# EAGLE board EEZ DIB MIO168 r1B1 (EAGLE 7.2.0), part 1 of 2
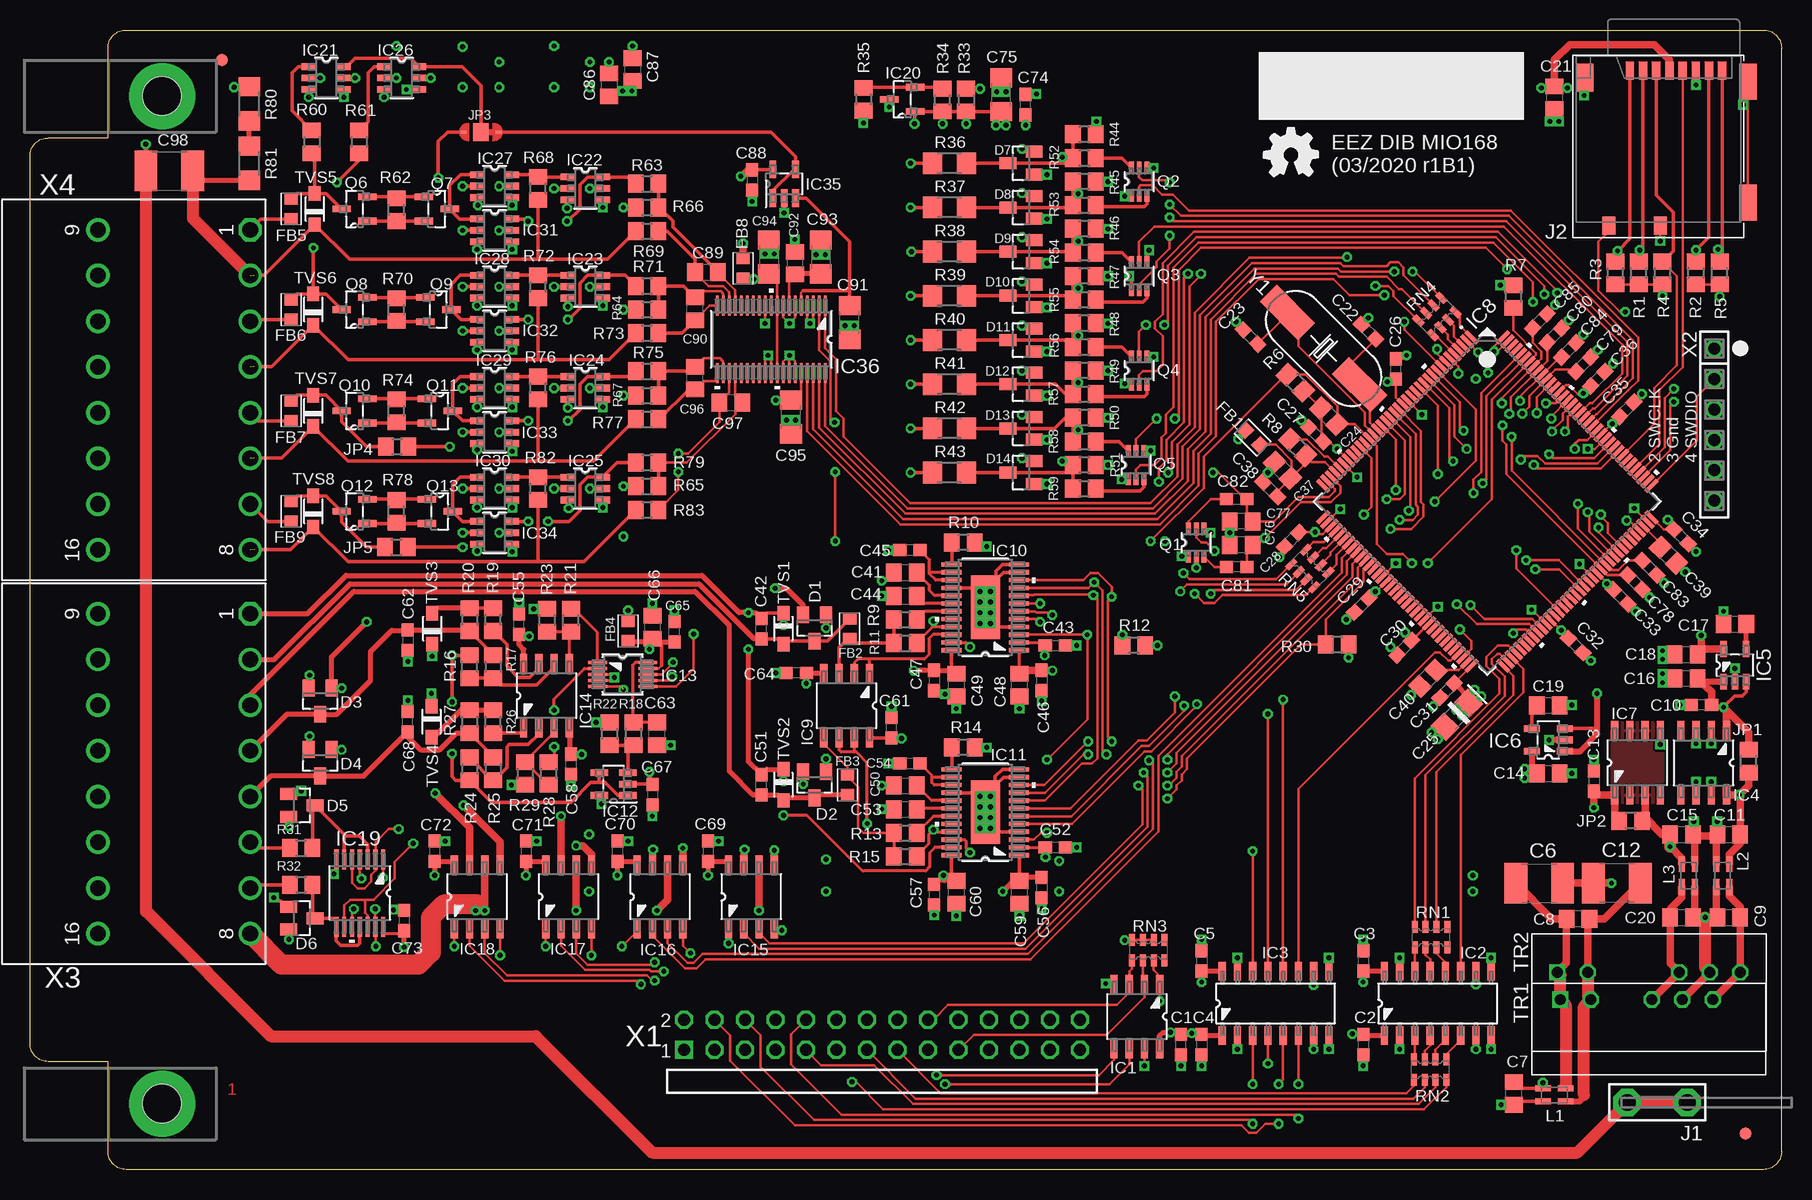
[diagram p6: board, top side]
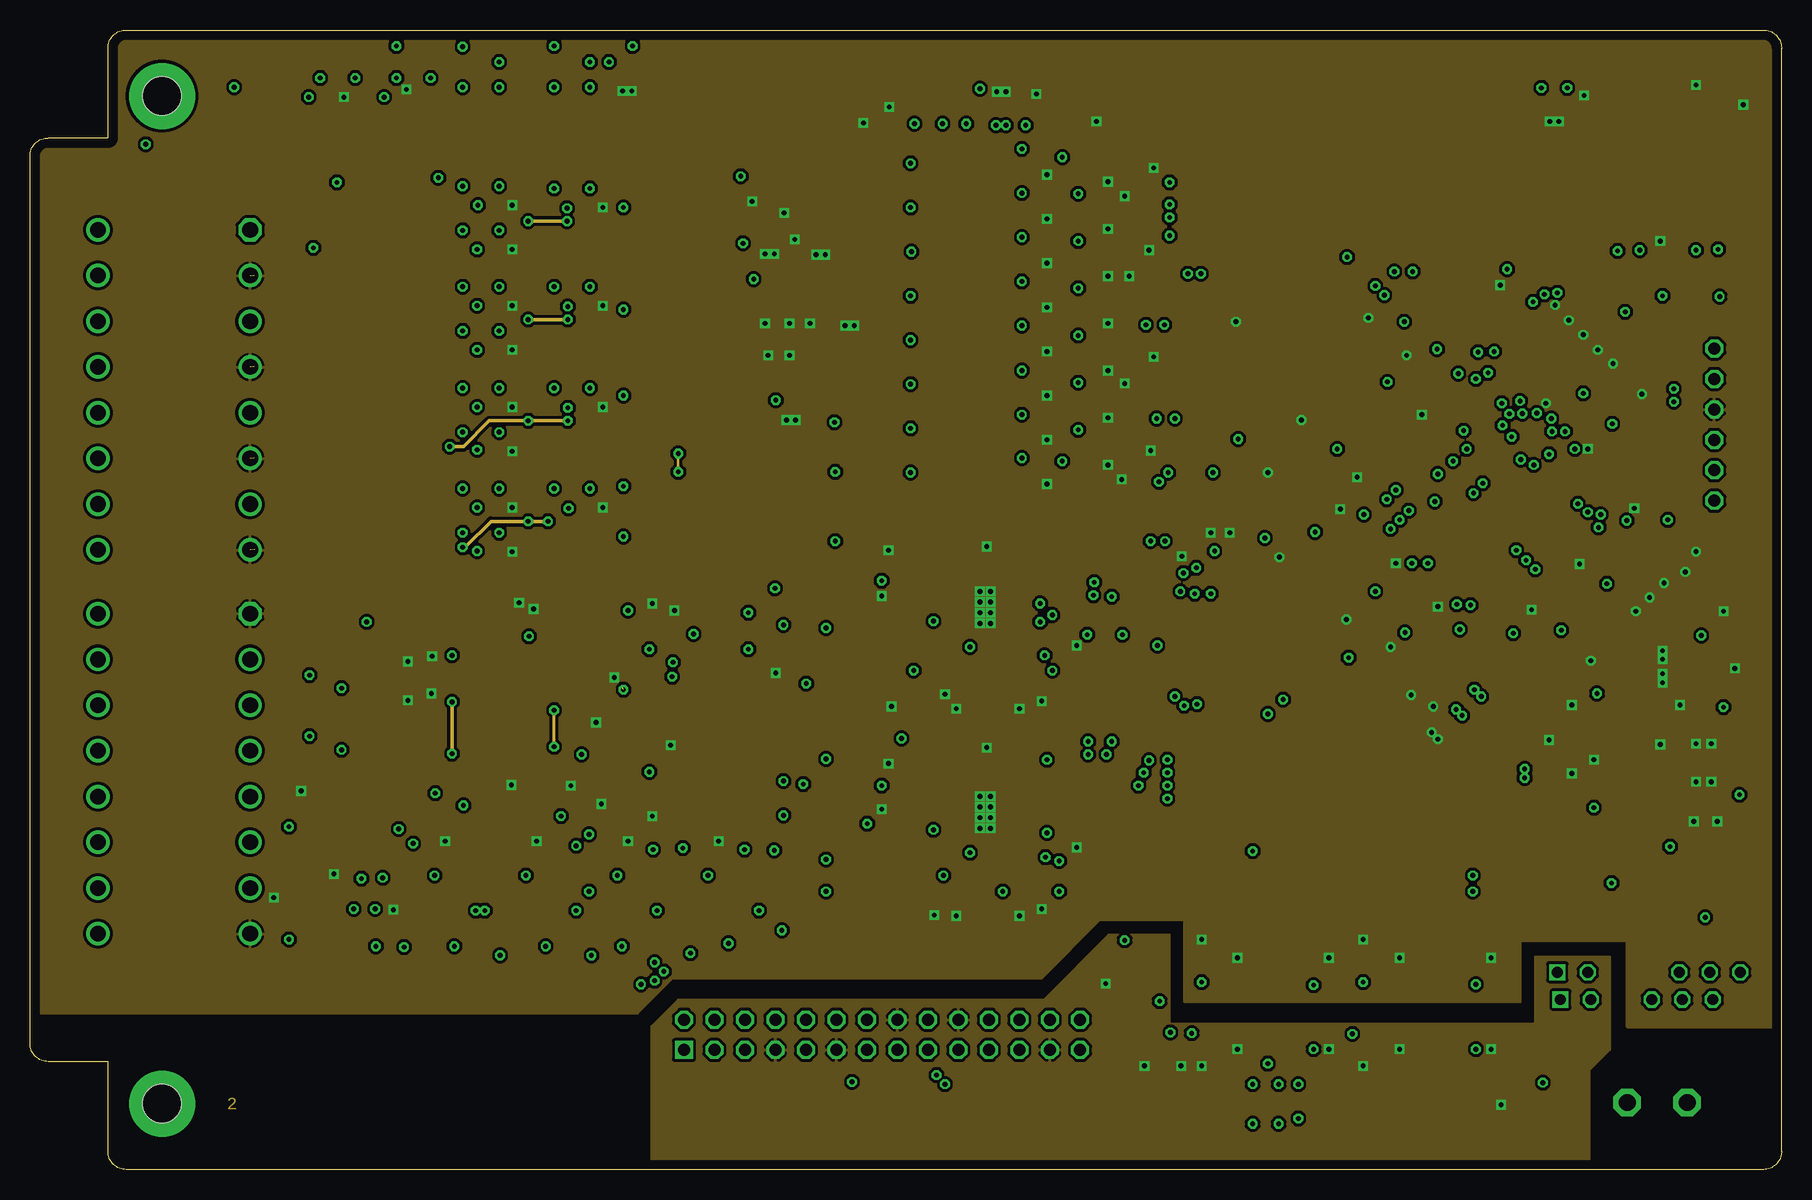
[diagram p7: board, inner layer L2]
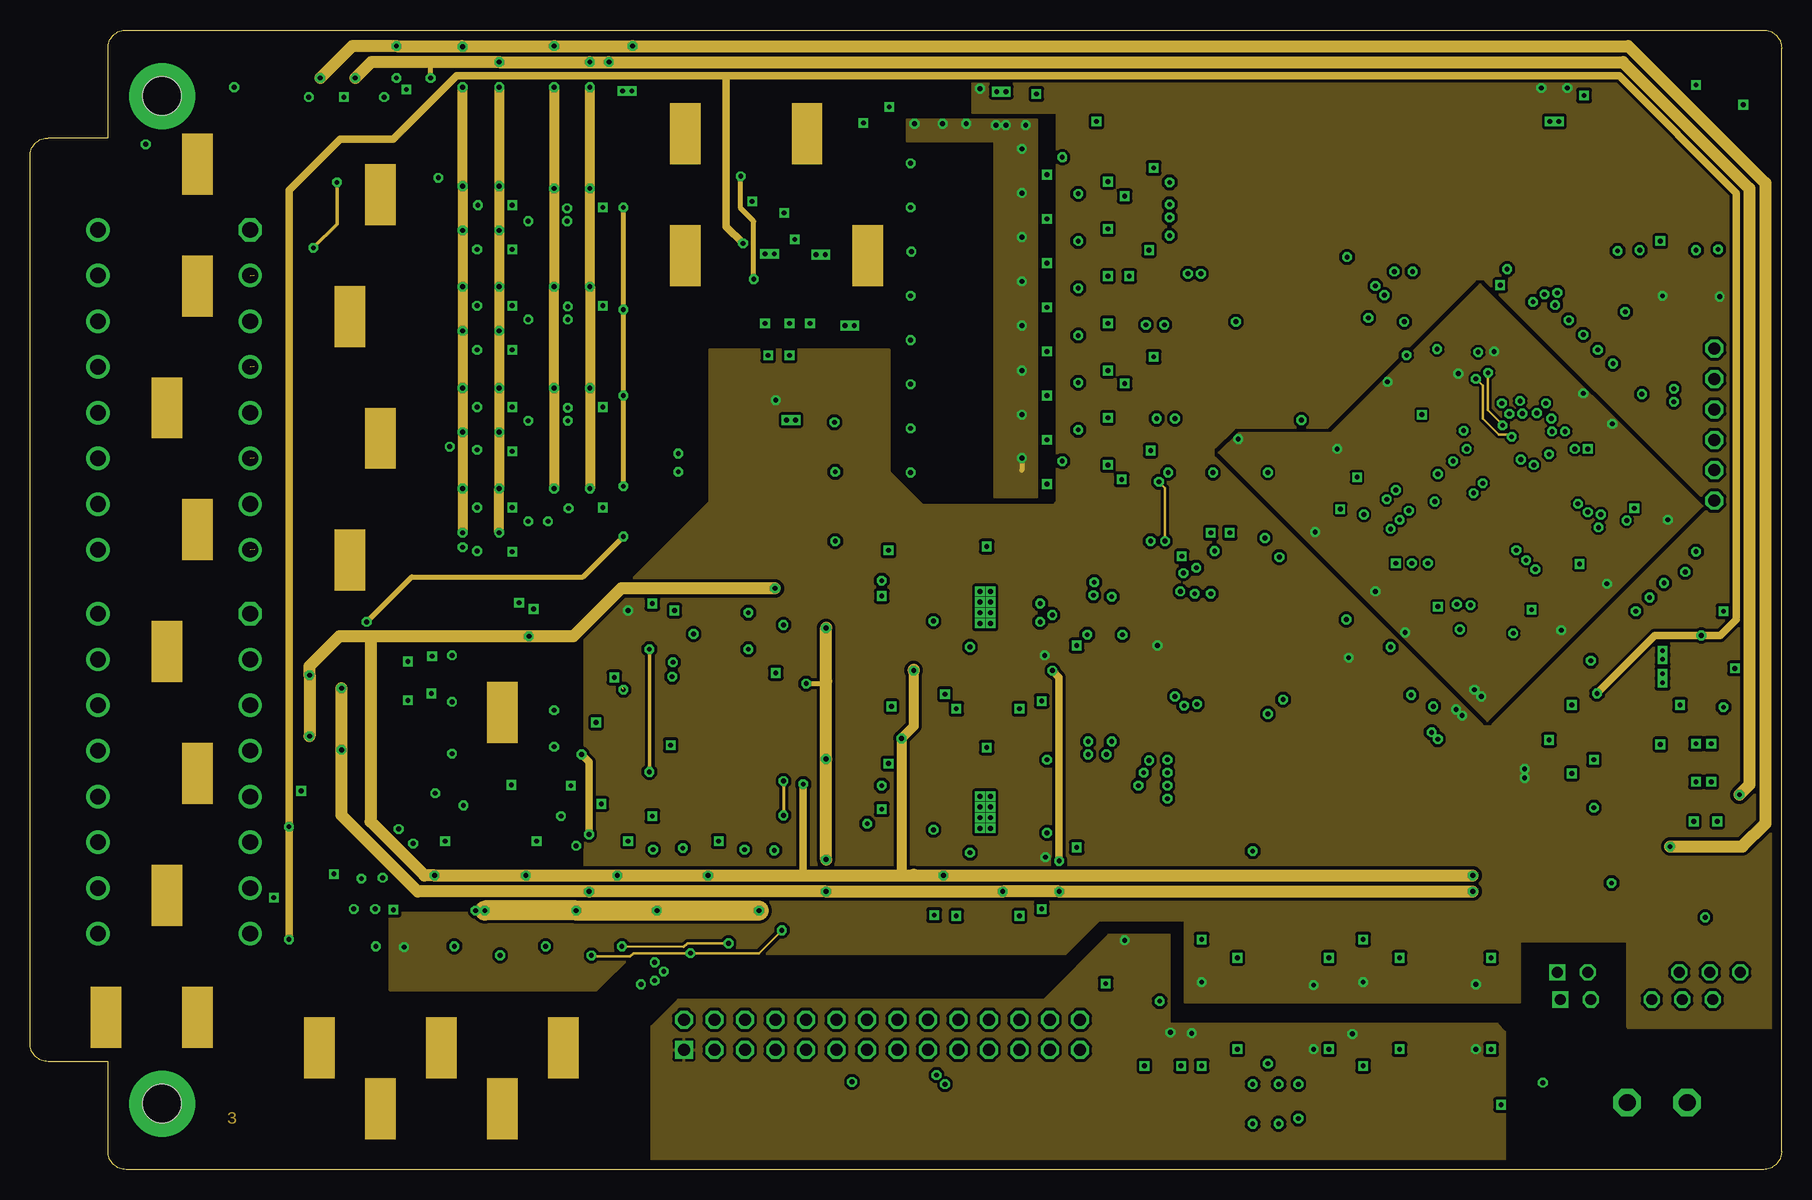
[diagram p8: board, inner layer L3]
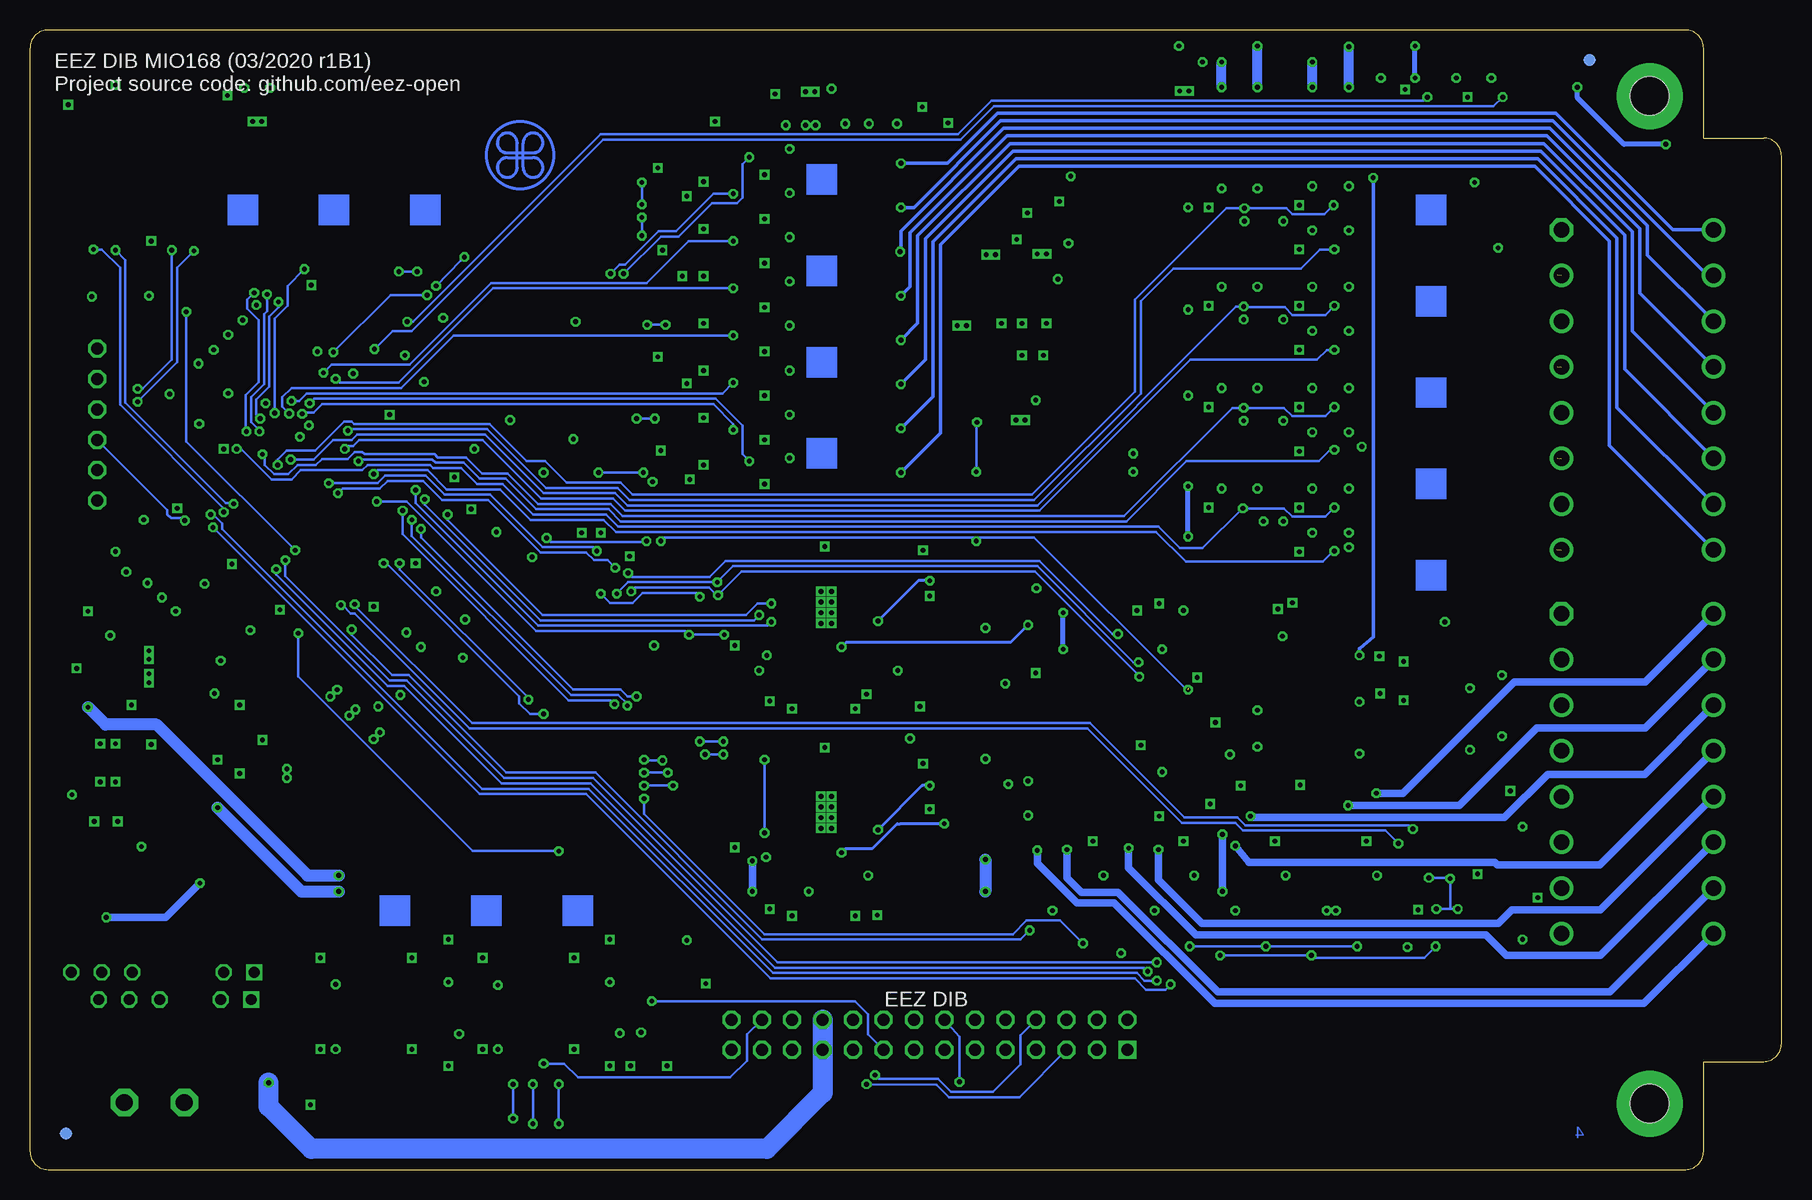
[diagram p9: board, bottom side, seen from below]

Size 146 x 95 mm. Coordinates in mm from the lower left corner, seen from the top.
Outline: 8,95 144.5,95 arc-90 146,93.5 146,1.5 arc-90 144.5,0 8,0 arc-90 6.5,1.5 6.5,9 1.5,9 arc-90 0,10.5 0,84.5 arc-90 1.5,86 6.5,86 6.5,93.5 arc-90 8,95
Copper layers (1+2+15+16): Top 0.035559375mm / dielectric 7mil / L2 0.03048125mm / dielectric 44mil / L3 0.03048125mm / dielectric 7mil / Bottom 0.035559375mm
Design rules "DIB 4-layer": minimum track width 6mil, minimum drill 0.3mm, track to track 4mil, track to pad 4mil, pad to pad 4mil, via to via 4mil, smd to smd 4mil, copper to edge 30mil, drill to drill 8mil, minimum pad ring 4mil, minimum via ring 8mil, stop-mask expansion 2.5mil, vias tented up to drill 0.6mm, thermal gap 8mil
Net classes: 0 default: width 0.203 mm, drill 0.3 mm, clearance 0.203 mm; 1 lvds: width 0.152 mm, drill 0.3 mm, clearance 0.152 mm to class 0, clearance 0.152 mm; 2 gnd: width 0.254 mm, drill 0.584 mm, clearance 0.254 mm; 3 diff_in: width 0.254 mm, drill 0.584 mm, clearance 0.203 mm to class 0, clearance 0.203 mm to class 1, clearance 0.203 mm to class 2, clearance 0.203 mm
vRestrict: area 0,0 to 42,14; area 53,0 to 128,8.5

## Footprints (pad centres in the part's own frame; a part is rotated, then mirrored left to right if it is on the bottom)
C0603 = smd 1.1 x 1: 1 -0.85,0; 2 0.85,0
C1812 = smd 1.9 x 3.4: 1 -1.95,0; 2 1.95,0
C0805 = smd 1.3 x 1.5: 1 -0.95,0; 2 0.95,0
EC1206 = smd 1.6 x 1.8: + -1.4,0; - 1.4,0
C1206 = smd 1.6 x 1.8: 1 -1.4,0; 2 1.4,0
SOT23 = smd 1 x 1.4: 1 -0.95,-1.1; 2 0.95,-1.1; 3 0,1.1
BEAD0603 = smd 1 x 1.1: P$1 -0.85,0; P$2 0.85,0
FIDUCIAL_DUAL = smd 1.016 x 1.016 bottom: B 0,0 | smd 1.016 x 1.016: T 0,0
SOIC127P600X173-8N = smd 1.55 x 0.6: 1 -2.7,1.9; 2 -2.7,0.63; 3 -2.7,-0.64; 4 -2.7,-1.91; 5 2.7,-1.91; 6 2.7,-0.64; 7 2.7,0.63; 8 2.7,1.9
SOIC-16 = smd 1.549 x 0.61: 1 -2.692,4.445; 2 -2.692,3.175; 3 -2.692,1.905; 4 -2.692,0.635; 5 -2.692,-0.635; 6 -2.692,-1.905; 7 -2.692,-3.175; 8 -2.692,-4.445; 9 2.692,-4.445; 10 2.692,-3.175; 11 2.692,-1.905; 12 2.692,-0.635; 13 2.692,0.635; 14 2.692,1.905; 15 2.692,3.175; 16 2.692,4.445
SOT95P270X145-5N = smd 1.321 x 0.559: 1 -1.372,0.94; 2 -1.372,0; 3 -1.372,-0.94; 4 1.372,-0.94; 5 1.372,0.94
LQFP-144 = smd 1.35 x 0.35: 1 -10.625,8.75; 2 -10.625,8.25; 3 -10.625,7.75; 4 -10.625,7.25; 5 -10.625,6.75; 6 -10.625,6.25; 7 -10.625,5.75; 8 -10.625,5.25; 9 -10.625,4.75; 10 -10.625,4.25; 11 -10.625,3.75; 12 -10.625,3.25; 13 -10.625,2.75; 14 -10.625,2.25; 15 -10.625,1.75; 16 -10.625,1.25; 17 -10.625,0.75; 18 -10.625,0.25; 19 -10.625,-0.25; 20 -10.625,-0.75; 21 -10.625,-1.25; 22 -10.625,-1.75; 23 -10.625,-2.25; 24 -10.625,-2.75; 25 -10.625,-3.25; 26 -10.625,-3.75; 27 -10.625,-4.25; 28 -10.625,-4.75; 29 -10.625,-5.25; 30 -10.625,-5.75; 31 -10.625,-6.25; 32 -10.625,-6.75; 33 -10.625,-7.25; 34 -10.625,-7.75; 35 -10.625,-8.25; 36 -10.625,-8.75; 73 10.625,-8.75; 74 10.625,-8.25; 75 10.625,-7.75; 76 10.625,-7.25; 77 10.625,-6.75; 78 10.625,-6.25; 79 10.625,-5.75; 80 10.625,-5.25; 81 10.625,-4.75; 82 10.625,-4.25; 83 10.625,-3.75; 84 10.625,-3.25; 85 10.625,-2.75; 86 10.625,-2.25; 87 10.625,-1.75; 88 10.625,-1.25; 89 10.625,-0.75; 90 10.625,-0.25; 91 10.625,0.25; 92 10.625,0.75; 93 10.625,1.25; 94 10.625,1.75; 95 10.625,2.25; 96 10.625,2.75; 97 10.625,3.25; 98 10.625,3.75; 99 10.625,4.25; 100 10.625,4.75; 101 10.625,5.25; 102 10.625,5.75; 103 10.625,6.25; 104 10.625,6.75; 105 10.625,7.25; 106 10.625,7.75; 107 10.625,8.25; 108 10.625,8.75 | smd 0.35 x 1.35: 37 -8.75,-10.625; 38 -8.25,-10.625; 39 -7.75,-10.625; 40 -7.25,-10.625; 41 -6.75,-10.625; 42 -6.25,-10.625; 43 -5.75,-10.625; 44 -5.25,-10.625; 45 -4.75,-10.625; 46 -4.25,-10.625; 47 -3.75,-10.625; 48 -3.25,-10.625; 49 -2.75,-10.625; 50 -2.25,-10.625; 51 -1.75,-10.625; 52 -1.25,-10.625; 53 -0.75,-10.625; 54 -0.25,-10.625; 55 0.25,-10.625; 56 0.75,-10.625; 57 1.25,-10.625; 58 1.75,-10.625; 59 2.25,-10.625; 60 2.75,-10.625; 61 3.25,-10.625; 62 3.75,-10.625; 63 4.25,-10.625; 64 4.75,-10.625; 65 5.25,-10.625; 66 5.75,-10.625; 67 6.25,-10.625; 68 6.75,-10.625; 69 7.25,-10.625; 70 7.75,-10.625; 71 8.25,-10.625; 72 8.75,-10.625; 109 8.75,10.625; 110 8.25,10.625; 111 7.75,10.625; 112 7.25,10.625; 113 6.75,10.625; 114 6.25,10.625; 115 5.75,10.625; 116 5.25,10.625; 117 4.75,10.625; 118 4.25,10.625; 119 3.75,10.625; 120 3.25,10.625; 121 2.75,10.625; 122 2.25,10.625; 123 1.75,10.625; 124 1.25,10.625; 125 0.75,10.625; 126 0.25,10.625; 127 -0.25,10.625; 128 -0.75,10.625; 129 -1.25,10.625; 130 -1.75,10.625; 131 -2.25,10.625; 132 -2.75,10.625; 133 -3.25,10.625; 134 -3.75,10.625; 135 -4.25,10.625; 136 -4.75,10.625; 137 -5.25,10.625; 138 -5.75,10.625; 139 -6.25,10.625; 140 -6.75,10.625; 141 -7.25,10.625; 142 -7.75,10.625; 143 -8.25,10.625; 144 -8.75,10.625
PWP24 = smd 1.676 x 0.356: 1 -2.819,3.575; 2 -2.819,2.925; 3 -2.819,2.275; 4 -2.819,1.625; 5 -2.819,0.975; 6 -2.819,0.325; 7 -2.819,-0.325; 8 -2.819,-0.975; 9 -2.819,-1.625; 10 -2.819,-2.275; 11 -2.819,-2.925; 12 -2.819,-3.575; 13 2.819,-3.575; 14 2.819,-2.925; 15 2.819,-2.275; 16 2.819,-1.625; 17 2.819,-0.975; 18 2.819,-0.325; 19 2.819,0.325; 20 2.819,0.975; 21 2.819,1.625; 22 2.819,2.275; 23 2.819,2.925; 24 2.819,3.575 | smd 2.413 x 5.283: 25 0,0
DBV5 = smd 1.473 x 0.559: 1 -1.194,0.95; 2 -1.194,0; 3 -1.194,-0.95; 4 1.194,-0.95; 5 1.194,0.95
DGS10 = smd 1.575 x 0.254: 1 -2.095,1; 2 -2.095,0.5; 3 -2.095,0; 4 -2.095,-0.5; 5 -2.095,-1; 6 2.095,-1; 7 2.095,-0.5; 8 2.095,0; 9 2.095,0.5; 10 2.095,1
PW14 = smd 1.676 x 0.356: 1 -2.819,1.95; 2 -2.819,1.3; 3 -2.819,0.65; 4 -2.819,0; 5 -2.819,-0.65; 6 -2.819,-1.3; 7 -2.819,-1.95; 8 2.819,-1.95; 9 2.819,-1.3; 10 2.819,-0.65; 11 2.819,0; 12 2.819,0.65; 13 2.819,1.3; 14 2.819,1.95
SOT103P240X110-3N = smd 1.524 x 0.559: 1 -1.079,1.016; 2 -1.079,-1.016; 3 1.079,0
DG6_TSOP6 = smd 1.194 x 0.559: 1 -1.448,0.95; 2 -1.448,0; 3 -1.448,-0.95; 4 1.448,-0.95; 5 1.448,0; 6 1.448,0.95
DBT38 = smd 1.676 x 0.229: 1 -2.819,4.5; 2 -2.819,4; 3 -2.819,3.5; 4 -2.819,3; 5 -2.819,2.5; 6 -2.819,2; 7 -2.819,1.5; 8 -2.819,1; 9 -2.819,0.5; 10 -2.819,0; 11 -2.819,-0.5; 12 -2.819,-1; 13 -2.819,-1.5; 14 -2.819,-2; 15 -2.819,-2.5; 16 -2.819,-3; 17 -2.819,-3.5; 18 -2.819,-4; 19 -2.819,-4.5; 20 2.819,-4.5; 21 2.819,-4; 22 2.819,-3.5; 23 2.819,-3; 24 2.819,-2.5; 25 2.819,-2; 26 2.819,-1.5; 27 2.819,-1; 28 2.819,-0.5; 29 2.819,0; 30 2.819,0.5; 31 2.819,1; 32 2.819,1.5; 33 2.819,2; 34 2.819,2.5; 35 2.819,3; 36 2.819,3.5; 37 2.819,4; 38 2.819,4.5
PCB_TAB-4907 = drill 1.4 pad 2.3 octagon: 1 -2.5,0; 2 2.5,0
5033981892 = smd 0.7 x 1.5: 1 4.45,12.6; 2 5.55,12.6; 3 6.65,12.6; 4 7.75,12.6; 5 8.85,12.6; 6 9.95,12.6; 7 11.05,12.6; 8 12.15,12.6 | smd 1.45 x 2.33: S 0.7,12.04 | smd 1.45 x 3: S1 14.3,11.7; S2 14.3,1.6 | smd 1.1 x 1.5: SW1 2.7,-0.3; SW2 7,-0.3
R_0805 = smd 1.3 x 1.5: 1 -0.95,0; 2 0.95,0
JP3-CUT = smd 1.27 x 1.524: COM 0,0 | smd 0.508 x 0.254: NC -1.46,0; NO 1.46,0
PCB-MB = hole 3.2: 0,0
MURATA_DLW21S = smd 1.3 x 0.5: 1 -0.95,-0.55; 2 0.95,-0.55; 3 0.95,0.55; 4 -0.95,0.55
SC88 = smd 0.991 x 0.406: 1 -1.168,0.65; 2 -1.168,0; 3 -1.168,-0.65; 4 1.168,-0.65; 5 1.168,0; 6 1.168,0.65
R0805 = smd 1.3 x 1.5: 1 -0.95,0; 2 0.95,0
R1206 = smd 1.6 x 1.803: 1 -1.422,0; 2 1.422,0
CAY16 = smd 0.5 x 1: 1 -1.35,-0.85; 2 -0.45,-0.85; 3 0.45,-0.85; 4 1.35,-0.85; 5 1.35,0.85; 6 0.45,0.85; 7 -0.45,0.85; 8 -1.35,0.85
SHORT_NOHOLE = smd 0.5 x 0.25 bottom: 1 0,0.117; 2 0,-0.117
TBA2 = drill 0.9 square: 1 0,0 | drill 0.9 octagon: 2 2.54,0; 4 7.62,0; 5 10.16,0; 6 12.7,0
MDD02 = drill 0.9 square: 1 0,0 | drill 0.9 octagon: 2 2.54,0; 5 10.16,0; 6 12.7,0; 7 15.24,0
SOD323-BIDIR = smd 1.2 x 1: C1 -1.3,0; C2 1.3,0
77317-104-28LF = drill 1 pad 1.5 square: 1 -33.02,-2.54 | drill 1 pad 1.5 octagon: 2 -33.02,0; 3 -30.48,-2.54; 4 -30.48,0; 5 -27.94,-2.54; 6 -27.94,0; 7 -25.4,-2.54; 8 -25.4,0; 9 -22.86,-2.54; 10 -22.86,0; 11 -20.32,-2.54; 12 -20.32,0; 13 -17.78,-2.54; 14 -17.78,0; 15 -15.24,-2.54; 16 -15.24,0; 17 -12.7,-2.54; 18 -12.7,0; 19 -10.16,-2.54; 20 -10.16,0; 21 -7.62,-2.54; 22 -7.62,0; 23 -5.08,-2.54; 24 -5.08,0; 25 -2.54,-2.54; 26 -2.54,0; 27 0,-2.54; 28 0,0
SSW-106-02-S-S = drill 1 pad 1.5 octagon: 1 -6.35,0; 2 -3.81,0; 3 -1.27,0; 4 1.27,0; 5 3.81,0; 6 6.35,0
691327310016 = drill 1.3 octagon: 1 -13.335,6.35 | drill 1.3: 2 -9.525,6.35; 3 -5.715,6.35; 4 -1.905,6.35; 5 1.905,6.35; 6 5.715,6.35; 7 9.525,6.35; 8 13.335,6.35; 9 -13.335,-6.35; 10 -9.525,-6.35; 11 -5.715,-6.35; 12 -1.905,-6.35; 13 1.905,-6.35; 14 5.715,-6.35; 15 9.525,-6.35; 16 13.335,-6.35
HC-49/4H = smd 4.5 x 2: 1 -4.25,0; 2 4.25,0

## Placement (x,y rotation side)
C1  100n  [C0603]  95.95,10.41 90 top
C2  100n  [C0603]  111.12,10.41 270 top
C3  100n  [C0603]  111.12,17.4 270 top
C4  100n  [C0603]  97.66,10.41 270 top
C5  100n  [C0603]  97.66,17.4 270 top
C6  4n7/1kV  [C1812]  125.79,23.88 0 top
C7  1u  [C0805]  123.7,6.35 90 top
C8  1u  [C0805]  129.03,20.89 180 top
C9  1u  [C0805]  141.6,21.02 0 top
C10  100n  [C0603]  139.32,38.73 180 top
C11  1u  [C0805]  141.6,27.94 0 top
C12  4n7/1kV  [C1812]  132.27,23.88 180 top
C13  100n  [C0603]  130.37,32.38 270 top
C14  2u2  [C0805]  126.56,33.02 0 top
C15  1u  [C0805]  137.67,27.94 0 top
C16  4u7  [C0805]  138.05,40.96 0 top
C17  10n  [C0805]  142.11,45.47 0 top
C18  4u7  [C0805]  138.05,42.93 0 top
C19  10n  [C0805]  126.56,38.67 180 top
C20  1u  [C0805]  137.67,21.02 0 top
C21  4u7  [C0805]  127.06,89.34 270 top
C22  18p  [C0603]  111.57,69.85 315 top
C23  18p  [C0603]  101.73,69.41 315 top
C24  1n  [C0805]  108.27,62.8 135 top
C25  4u7  [EC1206]  118.94,37.91 225 top
C26  100n  [C0603]  113.86,66.74 90 top
C27  100n  [C0603]  107.19,61.28 135 top
C28  100n  [C0603]  105.16,52.51 225 top
C29  100n  [C0603]  111,47.05 225 top
C30  100n  [C0603]  114.55,43.5 225 top
C31  100n  [C0603]  118.11,39.94 225 top
C32  100n  [C0603]  128.84,43.69 315 top
C33  100n  [C0603]  132.59,47.75 315 top
C34  100n  [C0603]  137.63,52.77 315 top
C35  100n  [C0603]  133.1,63.37 45 top
C36  100n  [C0603]  130.68,65.91 45 top
C37  1u  [C0805]  104.39,58.29 135 top
C38  100n  [C0603]  103.38,56.71 135 top
C39  2u2  [C0805]  136.58,51.21 135 top
C40  2u2  [C0805]  116.52,40.96 45 top
C41  2n2  [C0805]  72.96,49.78 0 top
C42  100n  [C0603]  60.96,45.09 90 top
C43  100n  [C0603]  85.47,43.69 0 top
C44  22n  [C0805]  72.96,47.82 0 top
C45  100n  [C0603]  73.34,51.63 180 top
C46  100n  [C0603]  84.33,40.77 270 top
C47  100n  [C0603]  75.37,40.77 270 top
C48  4u7  [C0805]  82.49,40.39 90 top
C49  4u7  [C0805]  77.22,40.39 90 top
C50  2n2  [C0805]  72.96,32 0 top
C51  100n  [C0603]  60.96,32.07 90 top
C52  100n  [C0603]  85.47,26.86 0 top
C53  22n  [C0805]  72.96,30.04 0 top
C54  100n  [C0603]  73.34,33.85 180 top
C55  100n  [C0603]  40.77,45.47 90 top
C56  100n  [C0603]  84.33,23.5 270 top
C57  100n  [C0603]  75.37,22.92 270 top
C58  100n  [C0603]  45.09,33.78 270 top
C59  4u7  [C0805]  82.49,23.11 90 top
C60  4u7  [C0805]  77.22,23.11 90 top
C61  100n  [C0603]  71.82,36.83 90 top
C62  100n  [C0603]  31.5,44.13 270 top
C63  150n  [C0805]  52.26,36.32 90 top
C64  100n  [C0603]  63.88,41.4 180 top
C65  100n  [C0603]  53.72,44.83 90 top
C66  4u7  [C0805]  51.88,45.21 270 top
C67  100n  [C0603]  51.88,31.24 270 top
C68  100n  [C0603]  31.5,37.34 90 top
C69  100n  [C0603]  56.52,26.54 270 top
C70  100n  [C0603]  48.96,26.54 270 top
C71  100n  [C0603]  41.34,26.54 270 top
C72  100n  [C0603]  33.72,26.54 270 top
C73  100n  [C0603]  31.18,20.76 270 top
C74  100n  [C0603]  82.99,88.77 90 top
C75  10u  [C1206]  80.96,89.6 90 top
C76  330p  [C0805]  100.97,52.07 180 top
C77  330p  [C0805]  100.97,54.04 180 top
C78  100n  [C0603]  133.79,48.96 315 top
C79  100n  [C0603]  129.48,67.12 45 top
C80  100n  [C0603]  127.06,69.53 45 top
C81  100n  [C0603]  100.58,50.23 180 top
C82  100n  [C0603]  100.58,55.88 180 top
C83  100n  [C0603]  135,50.16 315 top
C84  100n  [C0603]  128.27,68.33 45 top
C85  100n  [C0603]  125.86,70.74 45 top
C86  1u  [C0805]  48.26,90.42 270 top
C87  1u  [C0805]  50.23,91.69 270 top
C88  100n  [C0603]  60.2,82.49 270 top
C89  2n2  [C0805]  56.39,74.8 0 top
C90  2n2  [C0805]  55.44,71.75 90 top
C91  10u  [C1206]  68.33,70.61 90 top
C92  1u  [C0805]  63.75,75.56 270 top
C93  22u  [C1206]  65.91,76.07 270 top
C94  10u  [C1206]  61.59,76.07 270 top
C95  10u  [C1206]  63.44,62.74 90 top
C96  2n2  [C0805]  55.44,65.98 90 top
C97  2n2  [C0805]  58.42,63.94 0 top
C98  4n7/1kV  [C1812]  11.62,83.25 0 top
D1  BAT54SFILM  [SOT23]  65.41,45.15 180 top
D2  BAT54SFILM  [SOT23]  65.41,32.07 180 top
D3  BAT54SFILM  [SOT23]  24.19,39.05 180 top
D4  BAT54SFILM  [SOT23]  24.19,33.91 180 top
D5  BAT54SFILM  [SOT23]  22.67,30.35 270 top
D6  BAT54SFILM  [SOT23]  22.67,20.95 270 top
D7  BAT54SFILM  [SOT23]  82.61,83.88 90 top
D8  BAT54SFILM  [SOT23]  82.61,80.2 90 top
D9  BAT54SFILM  [SOT23]  82.61,76.52 90 top
D10  BAT54SFILM  [SOT23]  82.61,72.83 90 top
D11  BAT54SFILM  [SOT23]  82.61,69.15 90 top
D12  BAT54SFILM  [SOT23]  82.61,65.47 90 top
D13  BAT54SFILM  [SOT23]  82.61,61.79 90 top
D14  BAT54SFILM  [SOT23]  82.61,58.1 90 top
EEZ_SIGNATURE  SIGNATURESMALL  [SIGNATURE_5MM]  105.14,84.56 180 top
FB1  BLM18AG102SH1D  [BEAD0603]  101.92,61.02 315 top
FB2  BLM18AG102SH1D  [BEAD0603]  68.33,45.09 90 top
FB3  BLM18AG102SH1D  [BEAD0603]  68.14,32.07 270 top
FB4  BLM18AG102SH1D  [BEAD0603]  49.85,44.89 90 top
FB5  BLM18AG102SH1D  [BEAD0603]  21.78,80.07 90 top
FB6  BLM18AG102SH1D  [BEAD0603]  21.78,71.69 90 top
FB7  BLM18AG102SH1D  [BEAD0603]  21.78,63.25 90 top
FB8  BLM18AG102SH1D  [BEAD0603]  59.44,75.12 270 top
FB9  BLM18AG102SH1D  [BEAD0603]  21.78,54.86 90 top
FM1  FIDUCIAL_2  [FIDUCIAL_DUAL]  16,92.5 0 top
FM2  FIDUCIAL_2  [FIDUCIAL_DUAL]  143,3 0 top
IC1  M24C32-WMN6P  [SOIC127P600X173-8N]  92.27,12.76 270 top
IC2  Si8641BB-B-IS1  [SOIC-16]  117.35,13.84 90 top
IC3  Si8641BB-B-IS1  [SOIC-16]  103.82,13.84 90 top
IC4  L78L12  [SOIC127P600X173-8N]  139.51,33.91 270 top
IC5  LP2985-50DBVR  [SOT95P270X145-5N]  142.11,42.04 90 top
IC6  LP2985-33DBVR  [SOT95P270X145-5N]  126.56,35.81 180 top
IC7  L79L12  [SOIC127P600X173-8N]  133.99,33.91 90 top
IC8  STM32F446ZCT6  [LQFP-144]  121.48,55.69 315 top
IC9  OPA2196IDR  [SOIC127P600X173-8N]  68.07,38.67 270 top
IC10  DAC7760IPWPR  [PWP24]  79.63,46.86 180 top
IC11  DAC7760IPWPR  [PWP24]  79.63,29.78 180 top
IC12  OPA376AIDBVR  [DBV5]  48.64,32.13 180 top
IC13  DAC7563TDGSR  [DGS10]  49.4,41.27 0 top
IC14  OPA2196IDR  [SOIC127P600X173-8N]  43.05,39.5 90 top
IC15  BTS3408G  [SOIC127P600X173-8N]  60.13,22.73 90 top
IC16  BTS3408G  [SOIC127P600X173-8N]  52.51,22.73 90 top
IC17  BTS3408G  [SOIC127P600X173-8N]  44.89,22.73 90 top
IC18  BTS3408G  [SOIC127P600X173-8N]  37.27,22.73 90 top
IC19  74HC126PW,118  [PW14]  27.5,23.05 270 top
IC20  TL431B  [SOT103P240X110-3N]  72.71,89.22 180 top
IC21  DG468DV-T1-E3  [DG6_TSOP6]  24.7,91 0 top
IC22  DG468DV-T1-E3  [DG6_TSOP6]  46.29,81.79 0 top
IC23  DG468DV-T1-E3  [DG6_TSOP6]  46.29,73.6 0 top
IC24  DG468DV-T1-E3  [DG6_TSOP6]  46.29,65.15 0 top
IC25  DG468DV-T1-E3  [DG6_TSOP6]  46.29,56.77 0 top
IC26  DG468DV-T1-E3  [DG6_TSOP6]  30.99,91 0 top
IC27  DG468DV-T1-E3  [DG6_TSOP6]  38.73,81.98 0 top
IC28  DG468DV-T1-E3  [DG6_TSOP6]  38.73,73.6 0 top
IC29  DG468DV-T1-E3  [DG6_TSOP6]  38.73,65.15 0 top
IC30  DG468DV-T1-E3  [DG6_TSOP6]  38.73,56.77 0 top
IC31  DG468DV-T1-E3  [DG6_TSOP6]  38.73,78.3 0 top
IC32  DG468DV-T1-E3  [DG6_TSOP6]  38.73,69.91 0 top
IC33  DG468DV-T1-E3  [DG6_TSOP6]  38.73,61.47 0 top
IC34  DG468DV-T1-E3  [DG6_TSOP6]  38.73,53.09 0 top
IC35  OPA376AIDBVR  [DBV5]  62.87,82.17 90 top
IC36  ADS8674IDBT  [DBT38]  61.79,69.22 270 top
J1  4907  [PCB_TAB-4907]  135.64,5.59 180 top
J2  503398-1892  [5033981892]  128.91,78.99 0 top
JP1  JP2-CUT-0805  [R_0805]  143.26,34.04 90 top
JP2  JP2-CUT-0805  [R_0805]  133.41,29.08 180 top
JP3  JP3-CUT  [JP3-CUT]  37.59,86.49 180 top
JP4  JP2-CUT-0805  [R_0805]  30.61,60.26 0 top
JP5  JP2-CUT-0805  [R_0805]  30.54,51.88 0 top
KK1  PCB-MB  [PCB-MB]  11,89.5 0 top
KK2  PCB-MB  [PCB-MB]  11,5.5 0 top
L1  DLW21SN371SQ2L  [MURATA_DLW21S]  127.06,6.22 0 top
L2  DLW21SN371SQ2L  [MURATA_DLW21S]  141.1,24.51 90 top
L3  DLW21SN371SQ2L  [MURATA_DLW21S]  138.24,24.51 90 top
Q1  2N7002PS,115  [SC88]  97.22,52.26 90 top
Q2  2N7002PS,115  [SC88]  92.46,82.36 90 top
Q3  2N7002PS,115  [SC88]  92.46,74.49 90 top
Q4  2N7002PS,115  [SC88]  92.46,66.61 90 top
Q5  2N7002PS,115  [SC88]  92.2,58.74 90 top
Q6  BSS169  [SOT103P240X110-3N]  27.05,80.07 180 top
Q7  BSS169  [SOT103P240X110-3N]  33.91,80.07 0 top
Q8  BSS169  [SOT103P240X110-3N]  27.05,71.69 180 top
Q9  BSS169  [SOT103P240X110-3N]  34.04,71.69 0 top
Q10  BSS169  [SOT103P240X110-3N]  27.05,63.25 180 top
Q11  BSS169  [SOT103P240X110-3N]  34.16,63.25 0 top
Q12  BSS169  [SOT103P240X110-3N]  27.05,54.86 180 top
Q13  BSS169  [SOT103P240X110-3N]  34.16,54.86 0 top
R1  47K  [R0805]  134.11,74.74 90 top
R2  47K  [R0805]  138.87,74.74 90 top
R3  47K  [R0805]  132.14,74.74 90 top
R4  47K  [R0805]  136.08,74.74 90 top
R5  47K  [R0805]  140.84,74.74 90 top
R6  4K7  [R0805]  105.47,65.6 135 top
R7  10K  [R0805]  123.63,72.77 270 top
R8  47R  [R0805]  105.66,60.2 135 top
R9  15R  [R0805]  72.96,45.85 0 top
R10  N.C.  [R0805]  77.79,52.26 180 top
R11  15R  [R0805]  72.96,43.88 0 top
R12  10K  [R0805]  92.01,43.69 180 top
R13  15R  [R0805]  72.96,28.07 0 top
R14  N.C.  [R0805]  77.79,35.18 180 top
R15  15R  [R0805]  72.96,26.1 0 top
R16  9K09 0.1%  [R0805]  36.64,41.91 90 top
R17  75K 0.1%  [R0805]  38.61,41.91 270 top
R18  9K09 0.1%  [R0805]  50.29,36.32 270 top
R19  180R  [R0805]  38.61,45.85 90 top
R20  47R  [R0805]  36.64,45.85 270 top
R21  9K09 0.1%  [R0805]  45.09,45.78 90 top
R22  9K09 0.1%  [R0805]  48.32,36.32 90 top
R23  75K 0.1%  [R0805]  43.12,45.78 90 top
R24  9K09 0.1%  [R0805]  36.64,33.4 270 top
R25  75K 0.1%  [R0805]  38.61,33.4 270 top
R26  180R  [R0805]  38.61,37.34 90 top
R27  47R  [R0805]  36.64,37.34 270 top
R28  9K09 0.1%  [R0805]  43.24,33.02 90 top
R29  75K 0.1%  [R0805]  41.27,33.02 270 top
R30  10K  [R0805]  108.97,43.75 180 top
R31  100R  [R0805]  22.61,26.8 0 top
R32  100R  [R0805]  22.61,23.75 0 top
R33  100R  [R0805]  78.04,89.15 270 top
R34  470R  [R0805]  76.07,89.15 90 top
R35  1K8  [R0805]  69.47,89.22 270 top
R36  2K7  [R1206]  76.64,83.88 0 top
R37  2K7  [R1206]  76.64,80.2 0 top
R38  2K7  [R1206]  76.64,76.52 0 top
R39  2K7  [R1206]  76.64,72.83 0 top
R40  2K7  [R1206]  76.64,69.15 0 top
R41  2K7  [R1206]  76.64,65.47 0 top
R42  2K7  [R1206]  76.64,61.79 0 top
R43  2K7  [R1206]  76.64,58.1 0 top
R44  27K  [R0805]  87.88,86.3 180 top
R45  27K  [R0805]  87.88,82.36 180 top
R46  27K  [R0805]  87.88,78.42 180 top
R47  27K  [R0805]  87.88,74.49 180 top
R48  27K  [R0805]  87.88,70.55 180 top
R49  27K  [R0805]  87.88,66.61 180 top
R50  27K  [R0805]  87.88,62.67 180 top
R51  27K  [R0805]  87.88,58.74 180 top
R52  1K  [R0805]  87.88,84.33 0 top
R53  1K  [R0805]  87.88,80.39 0 top
R54  1K  [R0805]  87.88,76.45 0 top
R55  1K  [R0805]  87.88,72.52 0 top
R56  1K  [R0805]  87.88,68.58 0 top
R57  1K  [R0805]  87.88,64.64 0 top
R58  1K  [R0805]  87.88,60.71 0 top
R59  1K  [R0805]  87.88,56.77 0 top
R60  10K  [R0805]  23.5,85.66 270 top
R61  10K  [R0805]  27.43,85.66 270 top
R62  47R  [R0805]  30.54,80.01 90 top
R63  1K  [R0805]  51.44,82.17 0 top
R64  N.C.  [R0805]  51.44,71.69 0 top
R65  N.C.  [R0805]  51.44,56.96 0 top
R66  N.C.  [R0805]  51.44,80.2 0 top
R67  N.C.  [R0805]  51.44,64.52 0 top
R68  100R  [R0805]  42.35,81.79 90 top
R69  1K1  [R0805]  51.44,78.23 0 top
R70  47R  [R0805]  30.54,71.69 90 top
R71  1K  [R0805]  51.44,73.66 0 top
R72  100R  [R0805]  42.35,73.6 90 top
R73  1K1  [R0805]  51.44,69.72 0 top
R74  47R  [R0805]  30.54,63.25 90 top
R75  1K  [R0805]  51.44,66.55 0 top
R76  100R  [R0805]  42.35,65.15 90 top
R77  1K1  [R0805]  51.44,62.55 0 top
R78  47R  [R0805]  30.54,54.86 90 top
R79  1K  [R0805]  51.44,58.93 0 top
R80  560K  [R1206]  18.29,88.84 270 top
R81  560K  [R1206]  18.29,83.88 270 top
R82  100R  [R0805]  42.35,56.77 90 top
R83  1K1  [R0805]  51.44,54.99 0 top
RN1  DR1206-33R-4/8  [CAY16]  116.78,19.37 0 top
RN2  DR1206-33R-4/8  [CAY16]  116.71,8.32 180 top
RN3  DR1206-10K-4/8  [CAY16]  93.22,18.29 0 top
RN4  DR1206-33R-4/8  [CAY16]  117.28,71.12 225 top
RN5  DR1206-33R-4/8  [CAY16]  106.68,50.1 315 top
SH1  [SHORT_NOHOLE]  120.21,39.18 45 bottom
SH2  [SHORT_NOHOLE]  59.75,46.42 270 bottom
SH3  [SHORT_NOHOLE]  59.94,46.42 270 bottom
SH4  [SHORT_NOHOLE]  18.22,19.68 270 bottom
SH5  [SHORT_NOHOLE]  18.8,74.55 270 bottom
SH6  [SHORT_NOHOLE]  18.8,66.93 270 bottom
SH7  [SHORT_NOHOLE]  18.8,59.31 270 bottom
SH8  [SHORT_NOHOLE]  18.86,51.69 270 bottom
TR1  TBA2-1223  [TBA2]  127.57,14.16 0 top
TR2  MDD02M-15  [MDD02]  127.32,16.45 0 top
TVS1  PESD12VL1BA,115  [SOD323-BIDIR]  62.8,45.09 270 top
TVS2  PESD12VL1BA,115  [SOD323-BIDIR]  62.8,32.07 270 top
TVS3  PESD12VL1BA,115  [SOD323-BIDIR]  33.53,45.09 90 top
TVS4  PESD12VL1BA,115  [SOD323-BIDIR]  33.46,37.34 270 top
TVS5  PESD12VL1BA,115  [SOD323-BIDIR]  23.75,80.07 90 top
TVS6  PESD12VL1BA,115  [SOD323-BIDIR]  23.62,71.69 90 top
TVS7  PESD12VL1BA,115  [SOD323-BIDIR]  23.62,63.25 90 top
TVS8  PESD12VL1BA,115  [SOD323-BIDIR]  23.62,54.86 90 top
X1  77317-104-28LF  [77317-104-28LF]  87.54,12.5 0 top
X2  SSW-106-02-S-S  [SSW-106-02-S-S]  140.4,62.1 270 top
X3  691327310016  [691327310016]  12,33 270 top
X4  691327310016  [691327310016]  12,65 270 top
Y1  25MHz  [HC-49/4H]  107.82,68.45 315 top

## Tracks (layer width: path | path; a pad name or v marks a point on that pad's centre or on a via)
1V25_REF  (via drill 0.4)
  Top 0.305: IC12.1 49.02,31.18 47.94,32.26 47.43,32.26 | 47.43,32.26 46.74,32.26 45.09,30.61 38.48,30.61 R24.2 35.5,32.45 35.18,32.77 v35.18,34.67 | IC12.4 47.45,32.27 47.43,32.26 | R16.2 v35.18,42.86 v35.18,38.99 | JP3.NO 34.8,86.49 34.04,85.72 v34.04,82.68
  L2 0.305: v35.18,34.67 v35.18,38.99
  Bottom 0.305: v34.04,82.68 34.04,44.39 35.12,43.5 35.18,43.43 v35.18,42.86
2V5_REF
  Top 0.254: IC13.10 50.47,42.27 50.23,42.04 50.23,37.34 R18.1 C63.2
!ADC_CS
  Top 0.203: IC36.38 66.28,61.98 73.15,55.12 93.6,55.12 96.08,57.59 96.08,60.26 97.54,61.72 97.54,71.25 101.85,75.56 109.22,75.56 109.47,75.31 113.09,75.31 113.41,75.63 114.05,75.63 114.49,75.18 114.49,74.55 RN4.2
!DAC_ALARM  (via drill 0.4)
  Top 0.203: IC11.3 83.7,27.51 84.26,28.07 v84.77,28.07 | IC10.3 v88.13,44.59 88.14,44.58 88.14,37.53 v84.77,34.16 | R12.2 v91.06,44.58 | IC8.9 120.52,63.36 120.52,59.12 v117.09,55.69
  Bottom 0.203: v84.77,34.16 v84.77,28.07 | v88.13,44.59 91.05,44.59 v91.06,44.58 91.38,44.9 103.82,44.9 114.62,55.69 v117.09,55.69
!DAC_CS_DUAL  (via drill 0.4)
  Top 0.203: IC13.6 53.86,40.27 55.31,41.72 v55.31,44.64 | RN5.1 103.88,49.21 96.65,49.21 v96.14,49.72
  Bottom 0.203: v55.31,44.64 55.75,44.64 61.85,50.74 88.01,50.74 89.34,49.4 95.82,49.4 v96.14,49.72
!OUT_FAULT  (via drill 0.4)
  Top 0.203: IC18.1 v35.37,18.61 | IC17.1 v42.99,18.61 | IC15.1 v58.23,18.86 | IC8.48 111.12,49.94 111.12,48.96 108.02,45.85 R30.2 105.92,43.75 96.46,34.29 96.46,33.4 96.01,32.96 96.01,32.45 95.57,32 95.57,31.69 v94.81,30.92 | IC16.1 50.61,19.82 50.55,19.82 v49.34,18.61
  L3 0.203: v58.23,18.86 54.8,18.86 54.48,18.54 v49.34,18.61
  Bottom 0.203: v58.23,18.86 60.13,20.77 62.93,20.77 64.07,19.62 84.77,19.62 94.81,29.65 v94.81,30.92 | v35.37,18.61 v42.99,18.61 v49.34,18.61
!RESET  (via drill 0.4)  (1 unrouted)
  Top 0.203: IC36.2 65.78,68.33 66.74,67.37 66.74,62.17 66.83,62.07 v67.06,62.29 | IC13.5 49.2,40.27 v49.47,40.01 | v67.12,58.17 v67.12,52.39 | R6.2 106.33,66.27 108.97,63.63 108.97,62.16 C24.1 110.44,62.13 IC8.25 112.27,60.3 112.27,52.13 113.09,51.31 114.43,51.31 v115.19,50.55 | v93.41,52.39 97.85,56.83 97.85,59.44 104.69,66.27 R6.2 | 104.78,66.29 R6.2 | IC3.12 v104.46,39.18
  Bottom 0.203: v49.47,40.01 49.59,40.01 62.29,52.7 67.12,52.7 | 49.28,40.13 49.4,40.13 | v67.12,52.39 67.12,52.7 | v67.12,58.17 67.12,62.23 v67.06,62.29 | v104.46,39.18 104.46,39.31 115.19,50.04 v115.19,50.55 | 67.12,52.7 93.09,52.7 v93.41,52.39
+3V3  (via drill 0.4)
  Top 0.203: IC2.7 v120.52,10.03 | IC3.7 v107,10.03 | RN3.6 RN3.7 RN3.8 91.27,19.14 v91.25,19.11
  Top 0.406: v110.24,11.3 111.09,11.3 C2.1 111.24,11.15 IC2.1 | C1.2 96.73,11.26 v96.84,11.37 97.56,11.37 C4.1 97.78,11.15 IC3.1 | IC1.8 94.17,11.17 94.42,11.43 v95.06,11.43
  pour L3 (isolate 0.254): 54.04,14.16 84.52,14.16 89.92,19.56 95,19.56 95,12.19 122.3,12.13 122.94,11.49 122.94,-0.25 51.82,-0.25 51.82,11.94
+3V3_ISO  (via drill 0.4)
  Top 0.203: IC36.34 64.28,64.16 C95.2 | R30.1 v109.92,42.67 | SH1.2 119.38,38.35 v119.38,37.85 | R3.1 R1.1 R4.1 v136.08,72.83 | R2.1 R5.1 v140.84,72.77
  Top 0.254: IC19.14 29.45,19.77 29.53,19.68 30.96,19.68 C73.2 | IC10.2 84.37,43.94 C43.1 84.62,42.9 v84.58,42.86 | R12.1 v93.98,43.69 | IC11.2 C52.1 84.64,26.84 v84.64,26.04
  Top 0.406: R33.1 v79.18,90.1 v79.18,90.11 | C95.2 v62.17,64.14 | v49.85,46.61 FB4.P$2 | v31.18,18.54 C73.2 | IC3.16 97.68,16.54 C5.2 v97.66,15.62 | IC2.16 111.14,16.54 C3.2 v111.12,15.62 | IC2.10 v120.52,15.43 | IC3.10 v107,15.37
  Top 0.508: IC6.5 125.18,33.44 | 125.18,33.44 C14.1 | v124.59,33.4 125.14,33.4 125.18,33.44
  Top 0.61: J2.4 136.65,92.52 135.38,93.79 128.33,93.79 127.06,92.52 C21.1 127.06,90.17 v125.98,90.17
  other vias: 118.87,38.35 124.59,32.64 128.14,90.17
  pour L3 (isolate 0.254, rank 2): 49.28,48.51 46.23,45.47 46.23,21.34 29.97,21.34 29.97,14.99 47.24,14.99 50.29,18.03 86.36,18.03 89.15,20.83 96.27,20.83 96.27,13.97 124.21,13.97 124.21,19.05 133.16,19.05 133.16,11.87 145.54,11.87 145.54,93.98 144.78,94.74 78.55,94.61 78.55,88.14 85.6,88.14 85.6,55.63 85.34,55.37 74.42,55.37 71.63,58.17 71.63,68.33 56.64,68.33 56.64,55.63 49.53,48.51
+3V3_MCU  (via drill 0.4)
  Top 0.203: IC8.95 131.44,48.9 v131.44,48.83 131.51,48.83 C33.1 | C32.1 127.51,45.09 v127.64,44.96 127.48,45.09 IC8.84 | IC8.72 C31.1 | IC8.52 112.22,48.2 v112.14,48.2 C29.1 | C28.1 105.79,53.15 v107.12,53.15 107.31,52.96 107.78,52.96 IC8.39 | IC8.30 v108.97,60.07 108.33,60.71 C27.1 107.63,60.83 107.63,63.44 C24.2 R6.1 | IC8.17 113.86,64.37 C26.1 113.63,65.66 v113.16,65.66 | v129.48,64.71 129.09,64.64 | IC8.131 128.01,65.41 128.27,65.41 129.03,64.64 v129.48,64.71 | IC8.121 131.76,62.09 v131.89,62.17 | C35.1 v131.89,62.17 | 131.83,62.1 v131.89,62.17 | IC8.108 136.17,53.37 C34.1 137.03,53.66 v136.53,54.17 | FB1.P$1 101.32,61.5 v100.71,60.9 | C36.1 v129.48,64.71 | 129.41,64.64 v129.48,64.71 | IC8.144 122.05,68.64 v122.05,68.2 122.32,68.2 IC8.143 | C25.+ SH1.1 120.8,39.26 v120.97,39.43 | v119.06,66.36 119.06,66.94 IC8.6
  Top 0.254: IC8.62 115.19,44.1 C30.1 115.16,44.23 v114.62,44.77
  Top 0.406: C31.1 119.92,39.33 C25.+
  other vias: 120.4,40.01
  pour L3 (isolate 0.203): 120.84,73.79 120.9,73.79 139.38,55.31 121.48,37.4 99.12,59.75 100.77,61.4 108.46,61.4
+5V_ISO  (via drill 0.4)
  Top 0.305: IC6.3 130.54,36.75 130.62,36.83
  Top 0.508: IC6.1 129.24,34.87 130.62,36.26 130.62,36.83 v130.62,39.69
  Top 0.61: FB8.P$1 v59.44,77.22 | v139.32,44.51 139.32,43.25 C18.2 139.49,43.41 IC5.5 | v21.59,19.18 21.59,19.98 D6.2 | D5.2 21.57,28.6 v21.59,28.57
  L3 0.61: v59.44,77.22 58.04,78.61 58.04,91.12 57.98,91.19 | 57.98,91.19 35.56,91.19 30.29,85.92 25.84,85.92 21.59,81.66 v21.59,28.57 v21.59,19.18 | 57.98,91.19 132.46,91.19 142.24,81.41 142.24,45.85 140.91,44.51 v139.32,44.51 135.45,44.51 v130.62,39.69
+12V  (via drill 0.4)
  Top 0.305: C7.2 124.22,6.77 L1.4 v126.11,7.24
  Bottom 1.676: v126.11,7.24 126.11,5.27 122.56,1.71 84.58,1.71 79.92,6.38 X1.21 X1.22
+12V_ISO  (via drill 0.4)
  Top 0.305: IC10.24 76.81,41.37 C49.2 | IC9.8 C61.1 71.86,35.94 v72.64,35.94 | IC11.24 76.81,24.1 C60.2 | C10.1 140.55,38.54 v141.16,38.54 142.11,39.5 142.75,39.5 143.05,39.8 IC5.3
  Top 0.406: IC18.8 35.11,25.69 C72.2 v33.72,24.51 | IC17.8 42.73,25.69 C71.2 v41.34,24.51 | IC16.8 50.35,25.69 C70.2 v48.96,24.51 | IC15.8 57.97,25.69 C69.2 v56.52,24.51 | C49.2 76.49,41.62 C47.1 73.68,41.62 v73.66,41.59 | D2.2 v64.45,32.13 | v41.59,44.45 41.43,44.62 C55.1 40.77,43.75 41.15,43.37 IC14.8 | 76.81,24.1 76.2,24.1 | 76.2,24.1 75.7,24.1 C57.1 | v76.14,24.51 76.14,24.17 76.2,24.1 | v62.1,48.45 63.06,48.45 64.45,47.05 D1.2 | D4.2 23.24,36.07 v23.3,36.13 | D3.2 23.24,41.15 v23.3,41.21
  Top 0.508: 140.35,38.75 C10.1 | IC5.1 139.55,40.66 C16.2
  Top 0.61: IC4.1 141.41,38.3 v141.16,38.54 143.26,36.45 JP1.2 | C10.1 140.17,39.79 C16.2
  L3 0.61: v64.45,32.13 64.45,24.64 64.33,24.51
  L3 0.813: 72.39,24.51 72.64,24.77 v72.64,35.94 73.66,36.96 v73.66,41.59
  L3 1.016: v120.27,24.51 v76.14,24.51 73.72,24.51 73.66,24.57 73.6,24.51 72.39,24.51 64.33,24.51 v56.52,24.51 v48.96,24.51 v41.34,24.51 v33.72,24.51 32.89,24.51 28.38,29.02 28.38,44.45 | v73.66,41.59 73.66,41.66 | v62.1,48.45 49.28,48.45 45.28,44.45 v41.59,44.45 28.38,44.45 | v23.3,36.13 v23.3,41.21 23.3,41.97 25.78,44.45 28.38,44.45
  Bottom 1.016: v141.16,38.54 139.7,37.08 135.45,37.08 122.87,24.51 v120.27,24.51
+15V_ISO  (via drill 0.4)
  Top 0.305: IC31.5 v39.12,78.3 | IC27.5 v39.12,81.98 | IC22.5 v46.67,81.79 | IC34.5 v39.12,53.09 | IC30.5 v39.12,56.77 | v39.12,61.47 IC33.5 | v39.12,65.15 IC29.5 | v39.12,69.91 IC32.5 | v39.12,73.6 IC28.5 | IC23.5 v46.67,73.6 | IC24.5 v46.67,65.15 | IC25.5 v46.67,56.77
  Top 0.406: C86.1 v48.26,92.33 | IC26.5 v33.4,91 | IC21.5 v27.11,91
  Top 0.61: JP1.1 143.26,32 v142.49,31.24 | IC4.8 142.46,31.21 v142.49,31.24 | L2.2 141.65,26.27 142.56,27.18 C11.2 142.56,31.18 v142.49,31.24
  L3 0.406: v33.4,91 33.4,92.27 33.34,92.33
  L3 0.813: v39.12,53.09 v39.12,56.77 v39.12,61.47 v39.12,65.15 v39.12,69.91 v39.12,73.6 v39.12,78.3 v39.12,81.98 v39.12,90.23 | v46.67,56.77 v46.67,65.15 v46.67,73.6 v46.67,81.79 v46.67,90.23
  L3 1.016: v27.11,91 28.45,92.33 33.34,92.33 v39.12,92.33 v46.67,92.33 v48.26,92.33 132.78,92.33 143.32,81.79 143.32,32.07 v142.49,31.24
  Bottom 0.813: v46.67,90.23 v46.67,92.33 | v39.12,90.23 v39.12,92.33
-12V_ISO  (via drill 0.4)
  Top 0.254: IC10.1 82.45,41.37 C48.2
  Top 0.305: 66.11,41.43 IC9.4 | 64.58,41.62 C64.1 | C59.2 82.49,26.17 IC11.1 | R66.1 v49.47,80.2 | R64.1 v49.47,71.69 | R67.1 v49.47,64.52 | 66.42,46.18 66.42,45.21 v66.36,45.15
  Top 0.406: v81.09,23.18 81.98,24.06 C59.2 82.77,24.34 C56.1 | 64.58,41.55 C64.1 | R65.1 v49.47,56.96 | IC14.4 44.96,34.75 C58.1 45.95,34.63 v45.97,34.61 | D1.1 66.42,46.18 | v28.07,45.66 26.32,43.91 26.22,43.81 25.14,42.73 D3.1 25.16,40.13 v25.97,40.13 | D4.1 25.95,35.01 v25.97,34.99 | D2.1 v66.36,34.22 v66.36,34.23 | C64.1 64.73,40.54 v64.71,40.51 | IC9.4 64.76,41.37 C64.1
  Top 0.61: v85.22,41.59 84.35,41.59 C46.1 82.77,41.62 C48.2 | JP2.2 132.09,29.46 IC7.1 130.48,31.21 C13.2 v130.37,30.16
  L3 0.406: v49.47,56.96 v49.47,64.52 v49.47,71.69 v49.47,80.2 | v28.07,45.66 31.81,49.4 46.1,49.4 v49.47,52.77 | v64.71,40.51 66.17,40.51 66.36,40.7
  L3 0.61: v46.61,27.94 46.61,33.97 v45.97,34.61 | v85.22,41.59 85.79,41.02 v85.79,25.72
  L3 1.016: v25.97,40.13 v25.97,34.99 25.97,29.53 32.32,23.18 v46.61,23.18 v66.36,23.18 v81.09,23.18 v85.79,23.18 v120.27,23.18 | v66.36,25.84 v66.36,34.23 66.36,40.7 v66.36,45.15
  Bottom 0.406: v49.47,52.77 v49.47,56.96
  Bottom 0.61: v46.61,27.94 v46.61,23.18 | v85.79,25.72 v85.79,23.18
  Bottom 1.016: v66.36,25.84 v66.36,23.18 | v130.37,30.16 123.38,23.18 v120.27,23.18
-15V_ISO  (via drill 0.4)
  Top 0.305: IC27.2 v36.07,81.98 | IC31.2 v36.07,78.3 | IC22.2 v43.69,81.79 | IC28.2 v36.07,73.6 | IC32.2 v36.07,69.91 | IC29.2 v36.07,65.15 | IC33.2 v36.07,61.47 | IC30.2 v36.07,56.77 | IC34.2 v36.07,53.09 | IC23.2 v43.69,73.6 | v43.69,56.77 IC25.2 | IC24.2 v43.69,65.15
  Top 0.406: C87.1 v50.23,93.66 | IC21.2 v24.19,91 | IC26.2 v30.54,91
  Top 0.61: L3.3 137.69,25.95 v136.72,26.92 | IC7.3 134.62,29.34 | 134.62,29.34 JP2.1 | 134.62,29.34 136.03,27.94 C15.1
  Top 1.016: v136.72,26.92 C15.1
  L3 0.813: v43.69,90.23 v43.69,81.79 v43.69,73.6 v43.69,65.15 v43.69,56.77 | v36.07,93.6 36.01,93.66 | v36.07,90.23 v36.07,81.98 v36.07,78.3 v36.07,73.6 v36.07,69.91 v36.07,65.15 v36.07,61.47 v36.07,56.77 v36.07,53.09
  L3 1.016: v24.19,91 26.86,93.66 v30.54,93.66 36.01,93.66 v43.69,93.66 v50.23,93.66 133.22,93.66 144.65,82.23 144.65,28.83 142.75,26.92 v136.72,26.92
  Bottom 0.406: v30.54,91 v30.54,93.66
  Bottom 0.813: v43.69,90.23 v43.69,93.66 | v36.07,90.23 v36.07,93.6
  pour Top: 131.89,37.27 136.08,37.27 136.08,30.54 131.89,30.54
ADC_AVDD  (via drill 0.4)
  Top 0.203: C94.2 62.28,74.05 IC36.9 IC36.30
  Top 0.305: IC35.5 60.22,83.36 C88.1
  Top 0.406: FB8.P$2 60.29,74.27 v60.33,74.23 61.22,74.23 C94.2 | C88.1 59.78,83.34 v59.24,82.8
  L3 0.406: v59.24,82.8 59.24,80.14 60.33,79.06 v60.33,74.23
ADC_IRQ  (via drill 0.4)
  Top 0.203: IC36.35 64.78,61.58 72.58,53.78 94.17,53.78 97.41,57.02 97.41,59.69 98.87,61.15 98.87,70.67 102.42,74.23 108.65,74.23 109.98,72.9 v112.9,72.9 | IC8.2 120.7,68.14 v120.71,68.14
  Bottom 0.203: v120.71,68.14 115.95,72.9 v112.9,72.9
ADC_MISO
  Top 0.203: IC36.36 65.28,61.72 72.77,54.23 93.98,54.23 96.97,57.21 96.97,59.88 98.42,61.34 98.42,70.87 102.23,74.68 108.84,74.68 109.09,74.42 113.09,74.42 114.11,73.41 114.36,73.41 RN4.3
ADC_MOSI  (via drill 0.4)
  Top 0.203: IC36.1 66.28,68.46 67.18,67.56 67.18,63.25 67.82,62.61 67.82,61.09 73.34,55.56 93.41,55.56 95.63,57.78 95.63,60.45 97.09,61.91 97.09,71.44 101.66,76.01 109.72,76.01 v109.79,76.07 | v112.14,73.66 113.22,73.66 113.67,73.22 113.67,72.83 RN4.4
  Bottom 0.203: v109.79,76.07 110.11,75.75 v112.14,73.66
ADC_SCLK  (via drill 0.4)
  Top 0.203: IC36.37 65.78,61.85 72.96,54.67 93.79,54.67 96.52,57.4 96.52,60.07 97.98,61.53 97.98,71.06 102.04,75.12 109.03,75.12 109.28,74.87 v113.73,74.87 | v115.25,74.87 115.45,74.87 RN4.1
  Bottom 0.203: v113.73,74.87 v115.25,74.87
ADC_VREF
  Top 0.203: IC36.5 64.28,73.11 64.45,73.28
  Top 0.305: 64.45,73.28 68.33,73.28 | 68.33,73.28 68.33,77.34 64.69,80.97 IC35.3 | C91.2 68.33,73.28
AGND2
  Top 0.305: SH6.2 20.16,66.93 TVS6.C1 26.51,67.5 42.35,67.5 | R72.1 42.35,67.5 | 42.35,67.5 48.26,67.5 R73.1
AGND4
  Top 0.305: SH8.2 21.75,51.69 TVS8.C1 26.51,50.67 41.97,50.67 42.35,50.67 | R82.1 42.35,50.67 | R83.1 46.17,50.67 42.35,50.67
AIN0
  Top 0.305: TVS5.C2 22.23,81.37 FB5.P$2 | TVS5.C2 24.67,81.37 Q6.3 | 21.85,80.99 FB5.P$2 | 21.84,80.99 FB5.P$2 | R60.2 23.75,84.46 TVS5.C2
AIN1  (via drill 0.4)
  Top 0.305: TVS6.C2 24.67,72.99 Q8.3 | TVS6.C2 22.23,72.99 FB6.P$2 | v23.62,76.83 TVS6.C2 | R61.2 27.43,84.14 v25.59,82.3
  L3 0.305: v25.59,82.3 25.59,78.8 v23.62,76.83
AIN_0GND
  Top 0.203: IC36.17 58.28,73.16 57.78,73.66 56.58,73.66 C89.1
  Top 0.305: C89.1 55.44,75.88 53.09,78.23 R69.2
AIN_0P
  Top 0.203: IC36.16 58.78,73.29 57.34,74.74 C89.2
  Top 0.305: R63.2 R66.2 52.45,80.2 53.59,79.06 53.59,78.55 C89.2
AIN_1GND
  Top 0.203: IC36.19 56.66,72.03 C90.1
  Top 0.305: R73.2 54.35,69.72 C90.1
AIN_1P
  Top 0.203: IC36.18 57.78,73.03 57.59,73.22 55.95,73.22 C90.2
  Top 0.305: R64.2 R71.2 54.48,73.66 C90.2
AIN_2GND
  Top 0.203: IC36.20 57.28,65.73 57.28,65.72 56.13,65.72 C96.1
  Top 0.305: R77.2 52.45,62.55 54.93,65.03 C96.1
AIN_2P
  Top 0.203: IC36.21 57.78,67.37 57.53,67.63 56.14,67.63 C96.2
  Top 0.305: 52.9,65.03 R67.2 R75.2 55.06,66.55 C96.2
AIN_3GND  (via drill 0.4)
  Top 0.203: IC36.22 58.28,64.76 C97.1 57.47,62.3 54.86,59.69 v54.04,59.69 | v54.04,58.17 54.04,56.65 R83.2
  L2 0.203: v54.04,59.69 v54.04,58.17
AIN_3P
  Top 0.203: IC36.23 58.78,64.53 C97.2 58.8,63.38 58.8,62.99 54.74,58.93 R79.2
  Top 0.305: R79.2 R65.2
BOOT0  (via drill 0.4)
  Top 0.203: R7.2 123.64,69.98 125.54,68.07 125.54,67.89 IC8.138 121.86,64.2 121.86,55.88 v116.52,50.55 | IC3.13 v103.19,37.97
  Bottom 0.203: v103.19,37.97 104.33,37.97 105.22,38.86 105.22,39.43 116.33,50.55 v116.52,50.55
CLAMP  (via drill 0.4)
  Top 0.305: R33.2 77.53,88.2 | 77.53,88.2 R34.1 IC20.1 73.72,88.14 v73.72,87.19 | C75.1 77.54,88.2 77.53,88.2 | D7.2 82.93,84.83 v82.68,85.09 | D8.2 82.93,81.15 v82.68,81.41 | D9.2 82.93,77.47 v82.68,77.72 | D10.2 82.93,73.78 v82.68,74.04 | D11.2 82.93,70.1 v82.68,70.36 | D12.2 82.87,66.42 v82.68,66.61 | D13.2 82.87,62.74 v82.68,62.93 | D14.2 82.93,59.05 v82.68,59.31 | C74.1 v83,87.06
  L3 0.406: v82.68,59.31 82.68,58.29
  other vias: 80.52,87.06 81.34,87.06 78.04,87.19 76.07,87.19
  pour L3 (isolate 0.254): 73.09,87.5 83.95,87.5 83.95,56.07 80.39,56.07 80.39,85.72 73.09,85.72
CURR_SW0  (via drill 0.4)
  Top 0.203: IC27.3 37.29,80.44 v37.34,80.39 | IC8.117 130.92,58.42 125.67,58.42 v125.35,58.74
  Top 0.305: v44.77,80.14 44.77,80.76 IC22.3
  Bottom 0.203: v37.34,80.39 38.1,79.63 40.77,79.63 41.27,80.14 v44.77,80.14 46.29,80.14 53.91,72.52 53.91,64.83 62.48,56.26 95.76,56.26 96.77,57.28 101.28,57.28 103.06,59.05 104.58,59.05 107.7,62.17 119,62.17 119.19,62.36 119.83,62.36 122.24,59.94 124.59,59.94 125.35,59.18 v125.35,58.74
CURR_SW1  (via drill 0.4)
  Top 0.203: IC28.3 37.29,72.08 v37.27,72.01 | v44.83,71.94 44.83,72.63 IC23.3 | IC8.118 130.66,58.86 126.3,58.86 125.67,59.5 124.59,59.5 v124.27,59.18 124.52,59.44
  Bottom 0.203: v37.27,72.01 38.04,71.25 40.77,71.25 41.4,71.88 44.77,71.88 v44.83,71.94 45.47,71.94 62.04,55.37 96.2,55.37 97.22,56.39 103.19,56.39 108.08,61.28 118.75,61.28 119.19,60.83 120.71,60.83 122.36,59.18 v124.27,59.18
CURR_SW2  (via drill 0.4)
  Top 0.203: IC29.3 37.29,63.64 v37.27,63.56 | v44.83,63.5 44.83,64.19 IC24.3 | IC8.119 130.4,59.31 126.94,59.31 v126.62,59.63
  Bottom 0.203: v37.27,63.56 38.04,62.8 40.77,62.8 41.47,63.5 v44.83,63.5 45.78,63.5 54.8,54.48 96.58,54.48 97.6,55.5 103.63,55.5 106.17,58.04 108.33,58.04 109.67,59.37 112.01,59.37 112.27,59.63 118.11,59.63 118.3,59.82 118.94,59.82 119.51,59.24 121.67,59.24 122.17,58.74 123.7,58.74 124.46,57.98 125.67,57.98 126.43,58.74 126.43,59.44 v126.62,59.63
CURR_SW3  (via drill 0.4)
  Top 0.203: 44.9,55.77 IC25.3 | IC30.3 37.29,55.19 v37.27,55.18 | IC8.122 129.8,60.83 129.09,60.83 128.78,60.52 v128.78,60.07
  Top 0.305: 44.9,55.77 v44.9,55.12
  Bottom 0.203: v37.27,55.18 38.04,54.42 40.77,54.42 41.47,55.12 v44.9,55.12 44.96,55.12 48.26,51.82 50.16,51.82 51.94,53.59 96.97,53.59 97.98,54.61 104.08,54.61 106.62,57.15 108.71,57.15 110.05,58.48 112.39,58.48 112.65,58.74 117.86,58.74 118.3,58.29 123.44,58.29 124.21,57.53 125.86,57.53 128.4,60.07 v128.78,60.07
DAC_CLR#1  (via drill 0.4)
  Top 0.203: IC10.6 83.76,46.54 83.88,46.42 85.03,46.42 v85.22,46.23 | v113.09,55.88 114.17,55.88 114.62,56.33 114.62,60.78 IC8.21
  Bottom 0.203: v113.09,55.88 113.09,55.44 103.44,45.78 103,45.78 85.66,45.78 v85.22,46.23
DAC_CLR#2  (via drill 0.4)
  Top 0.203: IC11.6 86.8,29.46 92.65,35.31 93.28,35.31 96.2,38.23 v96.2,38.67 | v114.17,54.17 115.25,54.17 115.7,54.61 115.7,55.24 115.51,55.44 115.51,61.3 IC8.19
  Bottom 0.203: v96.2,38.67 96.2,38.8 96.97,39.56 100.9,39.56 114.17,52.83 v114.17,54.17
DAC_CLR-SEL#1  (via drill 0.4)
  Top 0.203: IC10.5 83.97,45.89 v84.2,45.66 | v113.86,56.64 113.86,60.84 IC8.22
  Bottom 0.203: v84.2,45.66 84.52,45.34 103.63,45.34 113.86,55.56 v113.86,56.64
DAC_CLR-SEL#2  (via drill 0.4)
  Top 0.203: IC11.5 82.47,28.83 86.87,28.83 92.9,34.86 93.47,34.86 97.28,38.67 v97.28,38.8 | IC8.20 115.06,61.04 115.06,55.05 v114.94,54.93
  Bottom 0.203: v114.94,54.93 114.94,52.96 101.09,39.12 97.6,39.12 v97.28,38.8
DAC_CS#1  (via drill 0.4)
  Top 0.203: IC10.7 v84.19,47.19 v84.2,47.18 | IC8.27 111.82,59.33 111.82,55.24 v111.19,54.61
  Bottom 0.203: v111.19,54.61 111.19,54.17 103.25,46.23 86.3,46.23 85.34,47.18 v84.2,47.18
DAC_CS#2  (via drill 0.4)
  Top 0.203: v113.41,53.4 115.13,53.4 116.14,54.42 116.14,55.44 115.95,55.63 115.95,61.57 IC8.18 | IC11.7 86.75,30.11 92.39,35.75 93.09,35.75 95.44,38.1 v95.44,39.43
  Bottom 0.203: v95.44,39.43 96.2,39.43 96.77,40.01 100.71,40.01 113.41,52.7 v113.41,53.4
DAC_MISO  (via drill 0.4)
  Top 0.203: IC10.10 87.81,49.14 88.39,49.72 89.03,49.72 90.17,48.58 v90.17,47.75 89.85,47.43 89.85,36.01 v90.17,35.69 | v88.2,35.69 84.57,32.06 IC11.10 | RN5.3 105.54,48.32 98.74,48.32 v98.42,48.01
  Bottom 0.203: v90.17,47.75 90.49,48.07 94.93,48.07 95.76,47.24 97.66,47.24 v98.42,48.01 | v90.17,35.69 v88.2,35.69
DAC_MOSI  (via drill 0.4)
  Top 0.203: IC10.9 88.24,48.49 v88.71,48.96 89.41,48.26 89.41,34.92 v89.72,34.61 | IC13.8 52.64,41.27 53.59,42.23 v53.59,42.29 | IC11.9 84.62,31.41 87.82,34.61 v88.2,34.61 | v97.09,48.01 97.85,47.24 98.74,47.24 99.38,47.88 106.37,47.88 RN5.4
  Bottom 0.203: v53.59,42.29 54.04,42.29 62.04,50.29 87.38,50.29 v88.71,48.96 96.14,48.96 v97.09,48.01 | v88.2,34.61 v89.72,34.61
DAC_OUT#1
  Top 0.305: C42.1 62.35,44.23 TVS1.C2 63.06,44.05 D1.3 66.46,44.05 68.33,45.91 FB2.P$2 68.29,45.94
  Top 0.406: X3.2 20.36,42.52 26.67,48.83 55.75,48.83 60.33,44.26 60.94,44.26 C42.1
DAC_OUT#2
  Top 0.406: FB3.P$2 65.66,31.22 D2.3 63,30.97 TVS2.C2 62.35,31.22 C51.1 60.29,31.22 58.29,33.21 58.29,45.34 55.44,48.2 26.99,48.2 18.35,39.56 X3.3
DAC_SCLK  (via drill 0.4)
  Top 0.203: IC13.7 53.22,40.77 v53.53,41.08 | IC10.8 82.49,47.88 83.69,47.88 83.76,47.94 88.58,47.94 v88.65,47.88 88.96,47.56 88.96,34.29 88.52,33.85 87.69,33.85 84.61,30.76 IC11.8 | RN5.2 104.71,48.77 96.46,48.77 v95.89,48.2
  Bottom 0.203: v95.89,48.2 95.57,48.51 89.41,48.51 88.77,47.88 v88.65,47.88 86.68,49.85 62.23,49.85 53.53,41.15 v53.53,41.08
DIB_A0  (via drill 0.4)
  Top 0.203: RN3.3 93.66,16.64 94.17,16.13 IC1.1 v94.17,14.04 v94.17,14.03
  Bottom 0.203: v94.17,14.03 77.22,14.03 76.14,12.95 76.14,11.26 X1.17
DIB_A1
  Top 0.203: RN3.2 92.77,15.59 IC1.2 92.9,14.35 89.79,11.24 78.68,11.24 77.4,9.96 X1.19
DIB_A2
  Top 0.203: RN3.1 91.87,16.75 91.63,16.51 IC1.3 91.57,15.4 91.57,14.67 90.61,13.72 76.52,13.72 75.3,12.5 X1.18
DIB_BOOT  (via drill 0.4)
  Top 0.203: v103.19,8.83 IC3.4
  Bottom 0.203: X1.26 86.23,11.27 86.23,9.08 87.63,7.68 100.33,7.68 101.47,8.83 v103.19,8.83
DIB_CSA
  Top 0.203: IC2.5 117.98,10.79 117.16,9.97 RN2.2
DIB_IRQ  (via drill 0.4)
  Top 0.203: X1.10 63.44,11.26 63.44,8.76 67.63,4.57 105.73,4.57 v105.73,4.25 | IC3.6 v105.73,7.11
  Bottom 0.203: v105.73,7.11 v105.73,4.25
DIB_MISO
  Top 0.203: IC2.6 119.25,10.79 118.06,9.61 RN2.1
DIB_MOSI
  Top 0.203: IC2.3 115.44,9.25 RN2.4
DIB_NRESET  (via drill 0.4)
  Top 0.203: X1.4 58.36,11.2 58.36,9.08 63.75,3.68 100.97,3.68 101.6,3.05 102.23,3.05 103,3.81 v104.08,3.81 | IC3.5 104.46,7.49 v104.08,7.11
  Bottom 0.203: v104.08,7.11 v104.08,3.81
DIB_SCL  (via drill 0.4)
  Top 0.203: IC1.6 91.63,8.76 89.98,7.11 v76.26,7.11
  Bottom 0.203: v76.26,7.11 70.42,7.05 69.41,6.03 63.53,6.03 X1.5
DIB_SCLK
  Top 0.203: IC2.4 116.71,10.35 116.27,9.91 RN2.3
DIB_SDA  (via drill 0.4)
  Top 0.203: IC1.5 90.36,9.14 89.09,7.87 v75.56,7.87
  Bottom 0.203: v75.56,7.87 75.25,7.56 70.29,7.56 69.22,6.48 65.72,6.48 63.44,8.76 63.44,11.2 X1.8
DIN0  (via drill 0.4)
  Top 0.203: C81.1 101.43,51.59 C76.1 102.36,52.07 v102.93,52.64 105.92,55.63 108.46,55.63 109.22,56.39 109.22,56.98 IC8.34 | 86.49,83.88 86.49,83.94 v86.04,84.39 | v94.11,57.34 94.11,58.48 94.74,59.12 94.74,60.83 96.2,62.29 96.2,74.36 v96.52,74.68
  Top 0.305: R44.2 R52.1 86.49,83.88 D7.3 R36.2
  L3 0.203: v86.04,84.39 86.3,84.14 | v94.61,52.39 94.61,56.83 v94.11,57.34
  Bottom 0.203: v86.04,84.39 86.61,83.82 86.61,81.03 87.06,80.58 89.15,80.58 91.95,77.79 93.41,77.79 v96.52,74.68 | v102.93,52.64 102.62,52.32 94.68,52.32 v94.61,52.39
DIN1  (via drill 0.4)
  Top 0.203: IC8.35 108.78,56.72 108.78,56.58 108.27,56.07 105.73,56.07 103.69,54.04 C77.1 101.43,54.52 C82.1 101.28,55.88 99.06,58.1 v98.61,58.1 | 86.93,80.9 v87.38,81.34 | v94.87,58.1 95.19,58.42 95.19,60.64 96.65,62.1 96.65,73.6 97.6,74.55 v97.6,74.68
  Top 0.305: R45.2 86.93,80.9 R53.1 86.74,80.2 D8.3 R37.2
  Bottom 0.203: v98.61,58.1 v94.87,58.1 | v87.38,81.34 89.03,81.34 92.14,78.23 93.6,78.23 96.39,75.44 96.84,75.44 v97.6,74.68
DIN2  (via drill 0.4)
  Top 0.203: C78.1 131.5,49.56 IC8.96 123.06,57.99 123.06,60.45 122.75,60.77 v122.75,62.04 | 86.93,77.09 v87.38,77.41
  Top 0.305: R46.2 86.93,77.09 R54.1 86.87,76.52 D9.3 R38.2
  L3 0.203: v121.54,66.42 121.54,63.31 122.75,62.1 v122.75,62.04
  Bottom 0.203: v87.38,77.41 91.12,77.41 94.61,73.91 107.57,73.91 114.36,67.12 120.84,67.12 v121.54,66.42
DIN3  (via drill 0.4)
  Top 0.203: C83.1 133.19,50.77 132.4,49.97 131.79,49.97 IC8.97 123.51,58.25 v123.51,61.09 | R55.1 86.93,73.03 v87.38,73.47
  Top 0.305: R47.2 R55.1 86.62,72.83 D10.3 R39.2
  L3 0.203: v120.52,65.91 121.09,65.34 121.09,62.61 122.43,61.28 123.32,61.28 v123.51,61.09
  Bottom 0.203: v87.38,73.47 107.38,73.47 115.25,65.6 120.21,65.6 v120.52,65.91
DIN4  (via drill 0.4)
  Top 0.203: C79.1 128.72,66.67 127.16,66.67 IC8.134 124.97,64.48 124.97,63.6 v124.4,63.02 | R56.1 86.93,69.15 v87.38,69.53
  Top 0.305: R40.2 D11.3 86.36,69.15 R56.1 R48.2
  Bottom 0.203: v87.38,69.53 110.68,69.53 115.06,65.15 124.21,65.15 124.97,64.39 124.97,63.6 v124.4,63.02
DIN5  (via drill 0.4)
  Top 0.203: C84.1 127.5,67.72 IC8.135 124.21,64.43 v124.21,64.07 | R57.1 86.93,65.15 v87.38,65.6
  Top 0.305: R49.2 R57.1 86.3,64.64 85.47,65.47 D12.3 R41.2
  Bottom 0.203: v87.38,65.6 88.27,64.71 122.94,64.71 123.57,64.07 v124.21,64.07
DIN6  (via drill 0.4)
  Top 0.203: C80.1 126.46,67.39 IC8.136 123.44,64.38 123.44,63.12 v123.32,62.99 | R50.2 87.31,62.3 | v87.38,61.66 87.38,61.15 R58.1
  Top 0.305: R42.2 D13.3 85.41,61.78 86.3,62.67 R50.2 R58.1
  Bottom 0.203: v123.32,62.99 123.19,63.12 122.36,63.12 121.67,63.82 89.03,63.82 87.38,62.17 v87.38,61.66
DIN7  (via drill 0.4)
  Top 0.203: C85.1 125.26,68.93 125.98,68.2 125.98,67.62 IC8.137 122.68,64.32 v122.68,63.88 | 86.93,58.1 R51.2 86.36,58.74 v86.04,59.05
  Top 0.305: R59.1 R51.2 86.3,58.1 D14.3 R43.2
  Bottom 0.203: v122.68,63.88 122.3,64.26 88.84,64.26 86.61,62.04 86.61,59.63 v86.04,59.05
DOUT0  (via drill 0.4)
  Top 0.203: 36.65,19.68 IC18.2 36.65,18.66 39.56,15.75 50.61,15.75 v50.93,15.43 | IC8.100 130.75,53.14 v130.75,53.53
  Bottom 0.203: v50.93,15.43 51.37,14.99 52.96,14.99 53.91,15.94 84.26,15.94 99.63,31.3 108.52,31.3 v130.75,53.53
DOUT1  (via drill 0.4)
  Top 0.203: v52.07,15.75 51.88,15.75 51.44,16.19 39.75,16.19 37.91,18.03 IC18.3 | IC8.101 131.51,53.08 131.51,53.91 130.94,54.48 v130.94,54.61
  Bottom 0.203: v52.07,15.75 53.09,15.75 53.72,16.38 84.07,16.38 99.44,31.75 108.33,31.75 129.98,53.4 129.98,53.85 130.75,54.61 v130.94,54.61
DOUT2  (via drill 0.4)
  Top 0.203: IC17.2 44.26,18.66 46.29,16.64 51.63,16.64 51.75,16.51 v52.83,16.51 | IC8.91 127.48,50.04 v125.48,50.04
  Bottom 0.203: v52.83,16.51 53.15,16.83 83.88,16.83 99.25,32.19 106.68,32.19 114.81,40.32 116.2,40.32 125.48,49.59 v125.48,50.04
DOUT3  (via drill 0.4)
  Top 0.203: v52.07,17.27 51.88,17.08 46.48,17.08 45.53,18.03 IC17.3 | IC8.92 127.43,50.8 v124.71,50.8
  Bottom 0.203: v52.07,17.27 83.69,17.27 99.06,32.64 106.49,32.64 114.62,40.77 116.01,40.77 124.71,49.47 v124.71,50.8
DOUT4
  Top 0.203: IC16.2 51.88,19.49 54.61,16.76 55.56,16.76 56.33,17.53 83.38,17.53 94.04,28.19 94.04,34.48 109.35,49.78 109.35,50.99 IC8.44
DOUT5  (via drill 0.4)
  Top 0.203: IC16.3 53.15,18.86 54.8,17.21 55.31,17.21 56.07,17.97 83.19,17.97 93.6,28.38 93.6,33.78 v93.28,34.1 | IC8.45 109.79,50.72 109.79,49.59 94.81,34.61 v94.81,34.16
  Bottom 0.203: v94.81,34.16 94.74,34.1 v93.28,34.1
DOUT6  (via drill 0.4)
  Top 0.203: IC15.2 59.51,19.68 60.77,18.41 83,18.41 93.15,28.57 93.15,32.77 v92.84,33.08 | IC8.46 110.24,50.46 110.24,49.4 95.57,34.73 95.57,33.85 v94.81,33.08
  Bottom 0.203: v94.81,33.08 v92.84,33.08
DOUT7  (via drill 0.4)
  Top 0.203: IC8.47 110.68,50.2 110.68,49.15 96.01,34.48 96.01,33.59 95.57,33.15 95.57,32.64 94.93,32 v94.81,32 | IC15.3 60.77,19.74 61.66,18.86 82.8,18.86 92.71,28.77 92.71,31.69 v92.39,32
  Bottom 0.203: v94.81,32 v92.39,32
FRM2
  cutout L2: 17.85,2.15 15.56,2.15 15.56,7.49 17.85,7.49
  cutout Top: 17.85,2.15 15.56,2.15 15.56,7.49 17.85,7.49
FRM3
  cutout L3: 17.85,2.15 15.56,2.15 15.56,7.49 17.85,7.49
GND  (via drill 0.4)  (4 unrouted)
  Top 0.203: IC13.3 48.45,41.27 v48.7,41.02 48.46,40.77 IC13.4 | R22.2 v47.18,37.27 | IC36.11 v61.28,70.56 v61.28,70.55 | C76.2 C77.2 v100.02,53.09 v100.01,53.09 | v65.53,76.26 65.53,77.03 C93.1 | C92.1 v63.75,77.53 | v62.04,76.33 62.04,77.09 C94.1 | IC36.8 62.78,71.07 v63.31,70.55 63.78,71.03 IC36.6 | IC36.28 61.28,67.64 v61.53,67.88 61.78,67.63 IC36.29 | IC36.31 62.78,67.36 v63.31,67.88 | IC36.33 63.78,67.41 v63.31,67.88 | IC36.32 63.28,67.86 v63.31,67.88 | IC36.4 64.78,70.79 v65.02,70.55 65.28,70.81 IC36.3 | v63.06,62.48 63.06,61.72 C95.1 | IC20.3 v71.63,88.58 | C61.2 v71.82,38.61 | v79.76,51.94 79.06,51.94 R10.1 | C23.1 100.52,70.61 v100.52,70.67 | C37.2 103.61,58.97 103.61,58.52 v103.19,58.1 102.78,57.69 C38.2 | C34.2 138.23,52.16 v138.88,51.51 | C39.1 v137.97,49.82 | C83.2 135.6,49.5 v136.21,48.9 | C78.2 134.4,48.29 v135,47.69 | C33.2 133.25,47.15 v133.86,46.55 | C32.2 129.38,43.28 v130.11,42.42 | IC8.94 v129.16,50.48 | IC8.83 125.19,46.67 v125.16,46.67 | IC8.107 133.73,55.1 v133.73,55.12 | C29.2 109.79,45.85 v109.73,45.85 | IC8.61 117.31,46.93 v117.35,46.93 | IC8.51 v113.86,50.54 v113.86,50.55 | IC8.38 109.17,55.05 v109.22,55.05 | IC8.31 110.61,57.72 v110.62,57.72 | C35.2 v134.37,64.64 | C36.2 v131.95,67.18 | IC8.16 v116,62.93 v116.01,62.93 | C27.2 v105.98,62.48 | v105.98,62.48 | C54.2 v71.56,33.85 | C25.- 117.47,36.45 v116.84,36.45 | C31.2 116.9,38.73 v116.97,38.61 | v115.13,39.56 115.85,40.22 C40.1 | C30.2 113.95,43.02 v113.41,43.56 | X3.8 18.38,19.66 SH4.1 | IC8.120 130.45,60.07 v129.86,60.07 | J2.SW2 135.91,77.42 v135.89,77.41 | v142.81,88.77 142.81,90.3 J2.S1 J2.S2 | v138.88,90.42 138.88,91.58 J2.6 | v129.54,89.53 129.54,90.97 J2.S
  Top 0.203: C57.2 v75.37,21.21 | C60.1 v77.22,21.14 | C59.1 v82.49,21.14 | C56.2 v84.33,21.72 | C85.2 126.46,71.4 v127.13,72.07 | C80.2 127.67,70.2 v128.27,70.8 | C84.2 128.87,68.99 v129.48,69.6 | C79.2 v130.68,68.33 | C28.2 104.56,51.47 v104.14,51.05 | C22.1 111.51,70.99 v111.57,70.99 | IC8.130 127.19,63.88 v126.36,63.88 | R7.1 v122.56,73.72 | v114.75,67.88 114.45,67.59 C26.2 | C53.1 v70.99,30.04 | C21.2 126.68,88.39 v126.68,87.38